# EAGLE design DF32-revision-C (EAGLE 6.6.0)
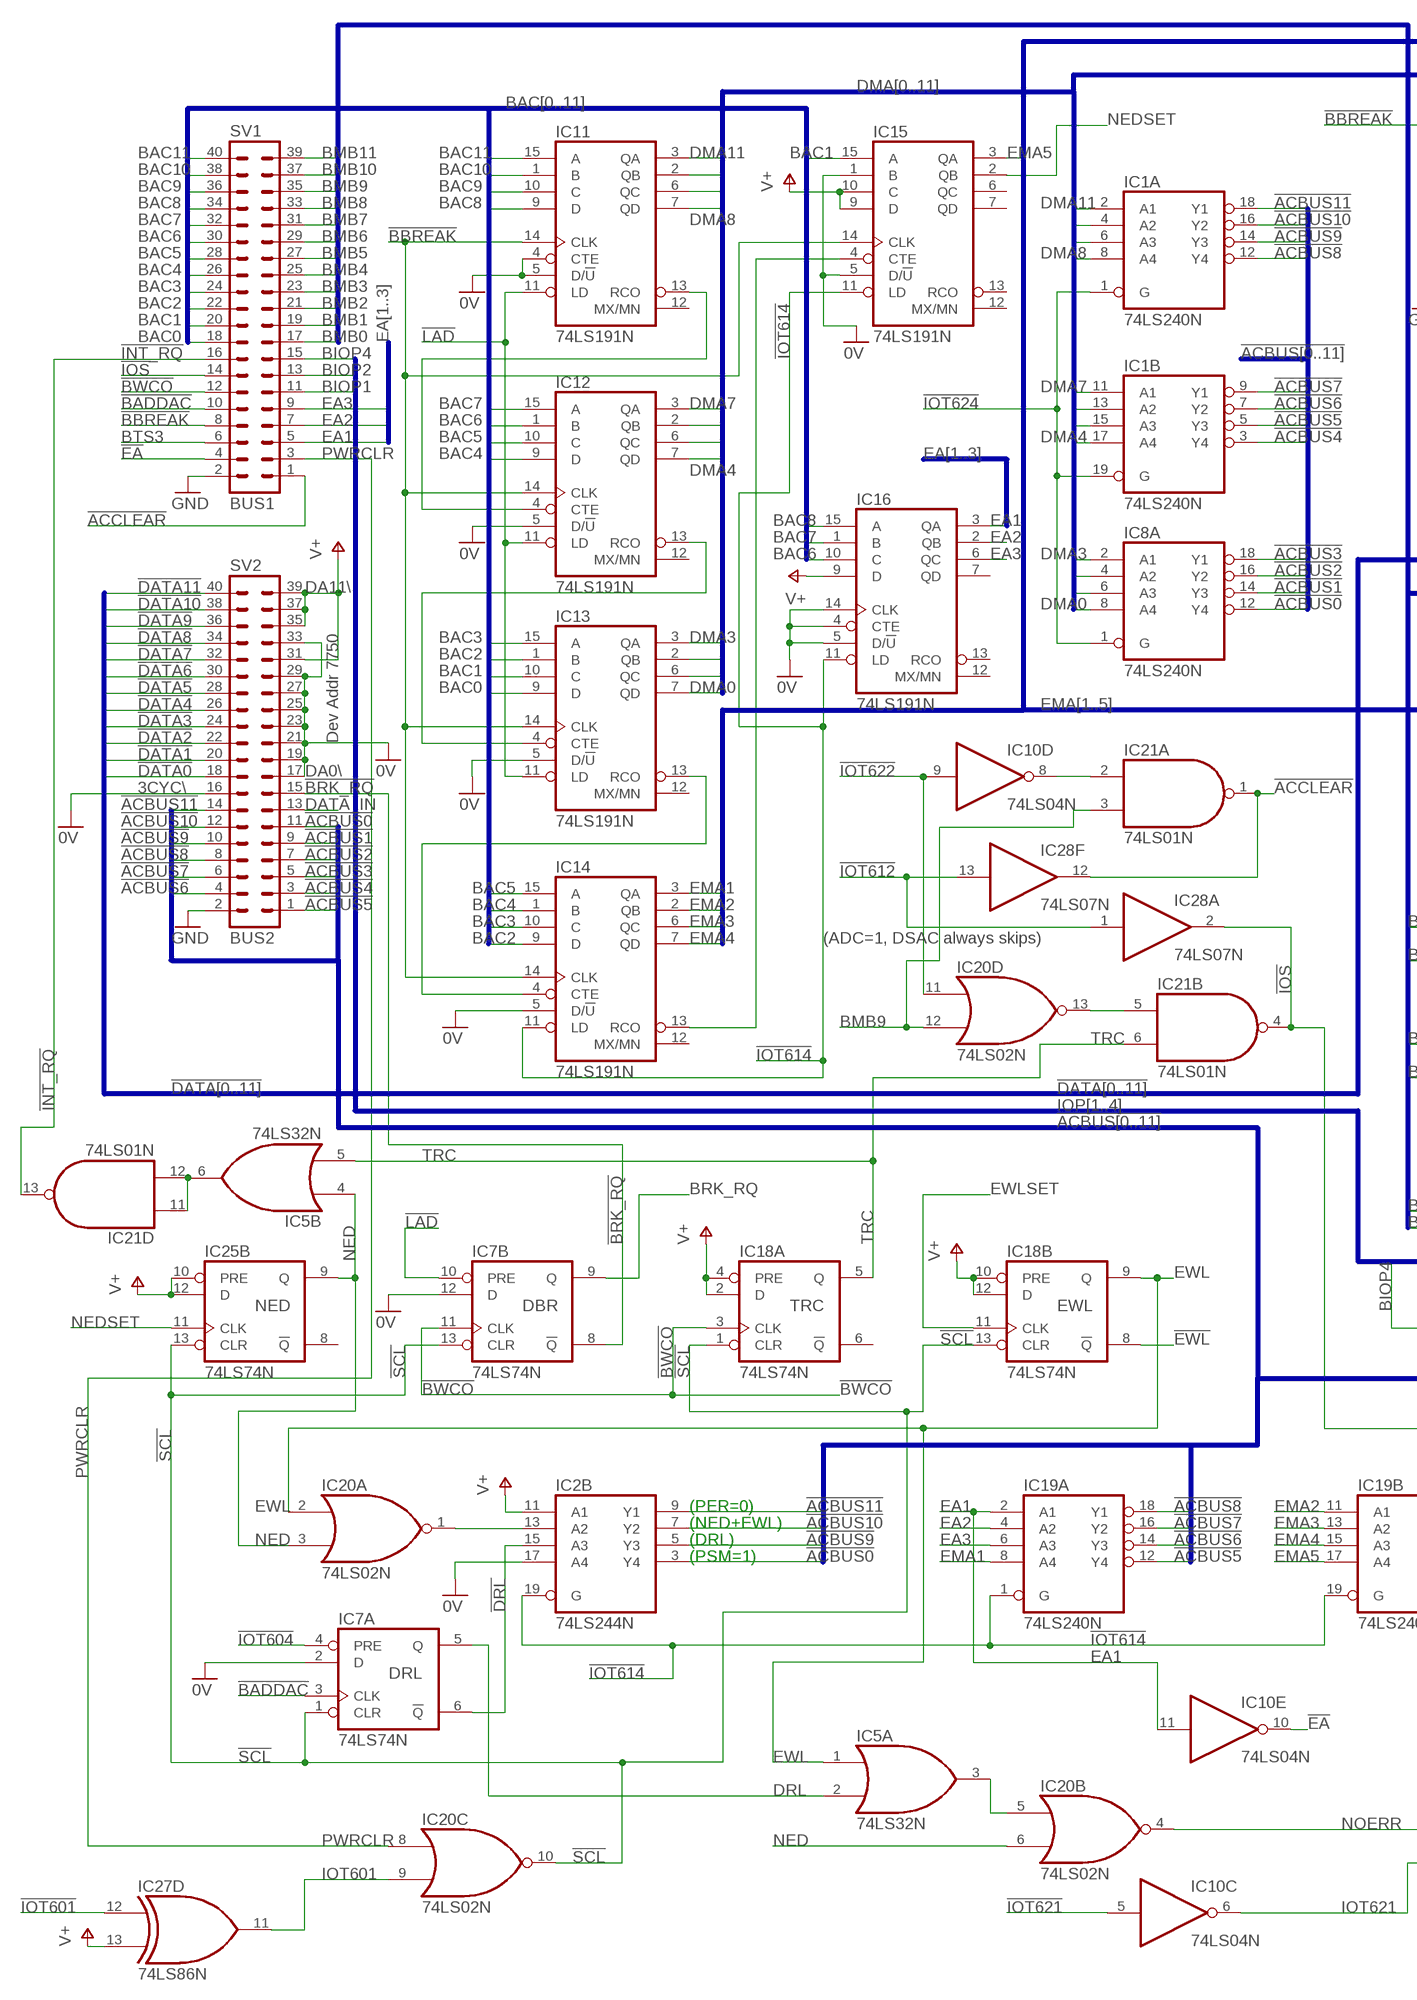
[diagram p0: schematic, sheet 1, part 1 of 2]
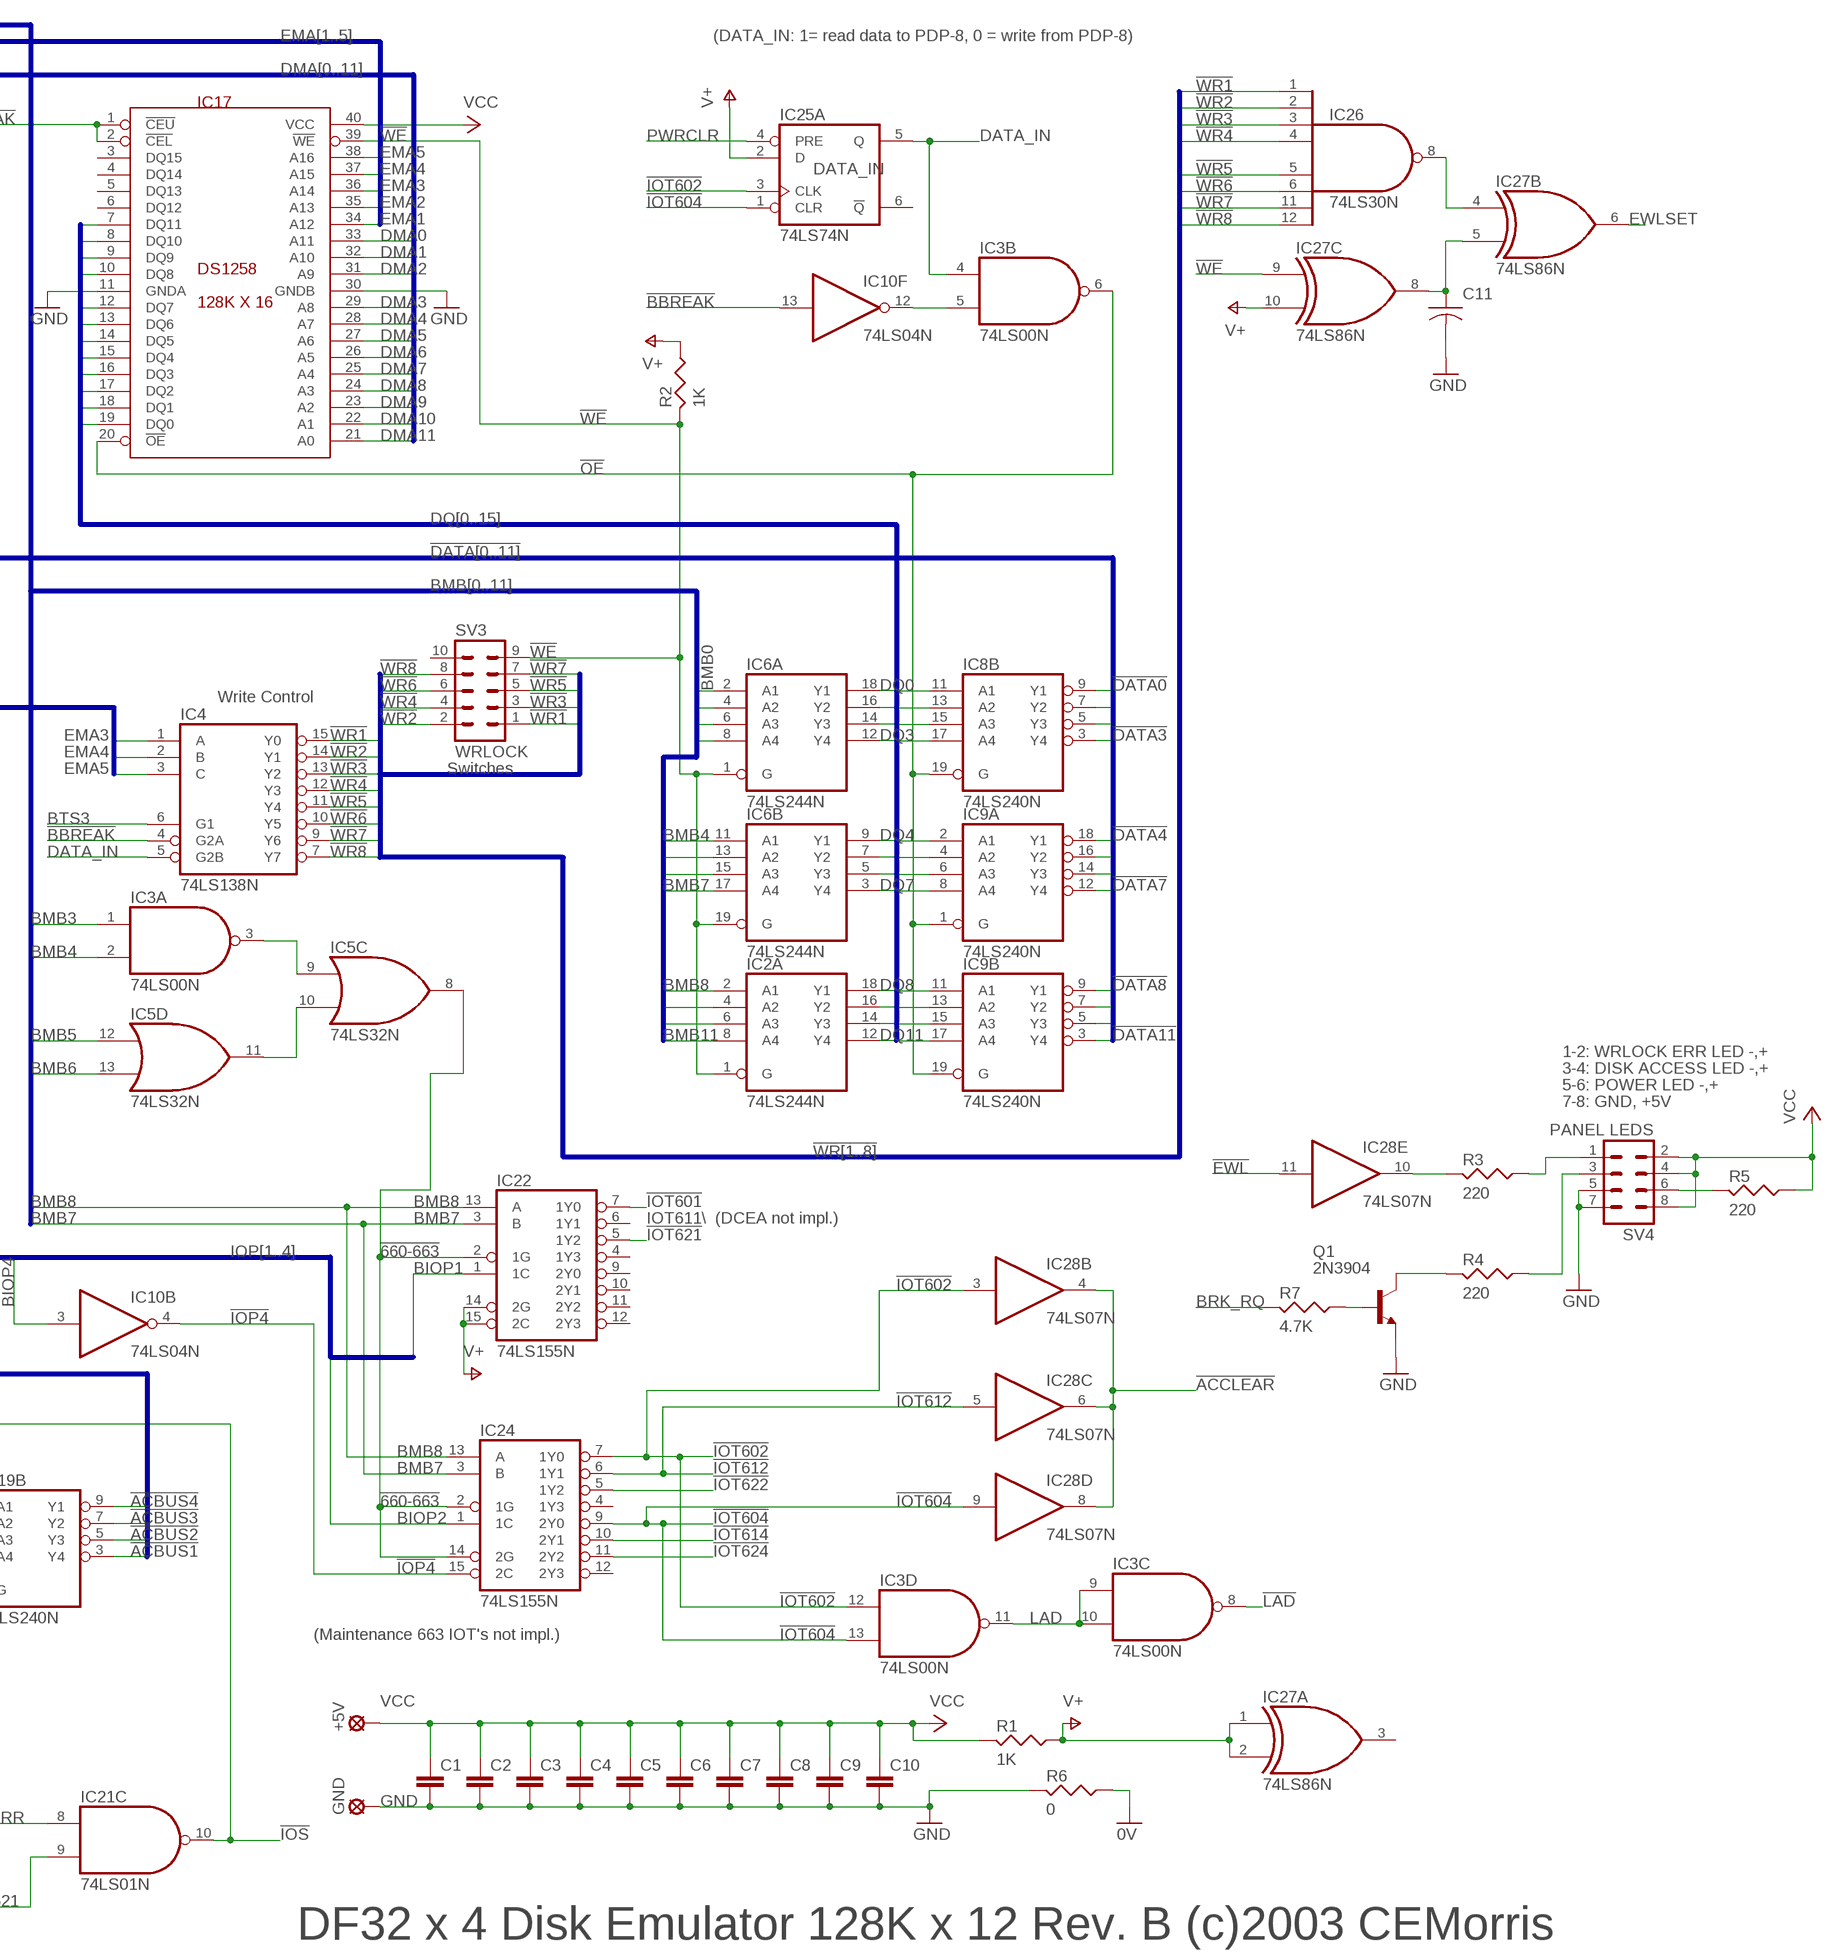
[diagram p1: schematic, sheet 1, part 2 of 2]

## Parts
+5V  SE14  [SE14]
C1  C5/3.5  [C5B3.5]
C2  C5/3.5  [C5B3.5]
C3  C5/3.5  [C5B3.5]
C4  C5/3.5  [C5B3.5]
C5  C5/3.5  [C5B3.5]
C6  C5/3.5  [C5B3.5]
C7  C5/3.5  [C5B3.5]
C8  C5/3.5  [C5B3.5]
C9  C5/3.5  [C5B3.5]
C10  C5/3.5  [C5B3.5]
C11  CAP-2,5  [C-2,5]
GND  SE14  [SE14]
IC1  74LS240N  [DIL20]
IC2  74LS244N  [DIL20]
IC3  74LS00N  [DIL14]
IC4  74LS138N  [DIL16]
IC5  74LS32N  [DIL14]
IC6  74LS244N  [DIL20]
IC7  74LS74N  [DIL14]
IC8  74LS240N  [DIL20]
IC9  74LS240N  [DIL20]
IC10  74LS04N  [DIL14]
IC11  74LS191N  74LS190N  [DIL16]
IC12  74LS191N  74LS190N  [DIL16]
IC13  74LS191N  74LS190N  [DIL16]
IC14  74LS191N  74LS190N  [DIL16]
IC15  74LS191N  74LS190N  [DIL16]
IC16  74LS191N  74LS190N  [DIL16]
IC17  DS1258  [DIL40]
IC18  74LS74N  [DIL14]
IC19  74LS240N  [DIL20]
IC20  74LS02N  [DIL14]
IC21  74LS01N  [DIL14]
IC22  74LS155N  [DIL16]
IC24  74LS155N  [DIL16]
IC25  74LS74N  [DIL14]
IC26  74LS30N  [DIL14]
IC27  74LS86N  [DIL14]
IC28  74LS07N  [DIL14]
Q1  2N3904  [TO92]
R1  1K  RESUS-5  [R-5]
R2  1K  RESUS-7,5  [R-7,5]
R3  220  RESUS-5  [R-5]
R4  220  RESUS-5  [R-5]
R5  220  RESUS-5  [R-5]
R6  0  RESUS-5  [R-5]
R7  4.7K  RESUS-5  [R-5]
SV1  BUS1  MA20-2  [MA20-2]
SV2  BUS2  MA20-2  [MA20-2]
SV3  WRLOCK  MA05-2  [MA05-2]
SV4  PANEL LEDS  MA04-2  [MA04-2]

## Nets
0V: IC2.17(B:A4) IC7.2(A:D) IC7.12(B:D) IC11.4(CTE) IC11.5(D/!U) IC12.5(D/!U) IC13.5(D/!U) IC14.5(D/!U) IC15.1(B) IC15.5(D/!U) IC16.4(CTE) IC16.5(D/!U) IC16.14(CLK) R6.1 SV2.16 SV2.17 SV2.19 SV2.21 SV2.23 SV2.25 SV2.27 SV2.29 SV2.33
!660-663: IC5.8(C:O) IC22.2(1G) IC24.2(1G) IC24.14(2G)
!(NED+EWL): IC2.13(B:A2) IC20.1(A:O)
!ACBUS0: IC2.3(B:Y4) IC8.12(A:Y4) SV2.11
!ACBUS1: IC8.14(A:Y3) IC19.3(B:Y4) SV2.9
!ACBUS2: IC8.16(A:Y2) IC19.5(B:Y3) SV2.7
!ACBUS3: IC8.18(A:Y1) IC19.7(B:Y2) SV2.5
!ACBUS4: IC1.3(B:Y4) IC19.9(B:Y1) SV2.3
!ACBUS5: IC1.5(B:Y3) IC19.12(A:Y4) SV2.1
!ACBUS6: IC1.7(B:Y2) IC19.14(A:Y3) SV2.4
!ACBUS7: IC1.9(B:Y1) IC19.16(A:Y2) SV2.6
!ACBUS8: IC1.12(A:Y4) IC19.18(A:Y1) SV2.8
!ACBUS9: IC1.14(A:Y3) IC2.5(B:Y3) SV2.10
!ACBUS10: IC1.16(A:Y2) IC2.7(B:Y2) SV2.12
!ACBUS11: IC1.18(A:Y1) IC2.9(B:Y1) SV2.14
!ACCLEAR: IC21.1(A:O) IC28.4(B:O) IC28.6(C:O) IC28.8(D:O) IC28.12(F:O) SV1.1
!BADDAC: IC7.3(A:CLK) SV1.10
!BBREAK: IC4.4(G2A) IC10.13(F:I) IC11.14(CLK) IC12.14(CLK) IC13.14(CLK) IC14.14(CLK) IC15.14(CLK) IC17.1(!CEU) IC17.2(!CEL) SV1.8
!BRK_RQ: IC7.8(B:!Q) SV2.15
!BWCO: IC7.11(B:CLK) IC18.3(A:CLK) SV1.12
!DATA0: IC8.9(B:Y1) SV2.18
!DATA1: IC8.7(B:Y2) SV2.20
!DATA2: IC8.5(B:Y3) SV2.22
!DATA3: IC8.3(B:Y4) SV2.24
!DATA4: IC9.18(A:Y1) SV2.26
!DATA5: IC9.16(A:Y2) SV2.28
!DATA6: IC9.14(A:Y3) SV2.30
!DATA7: IC9.12(A:Y4) SV2.32
!DATA8: IC9.9(B:Y1) SV2.34
!DATA9: IC9.7(B:Y2) SV2.36
!DATA10: IC9.5(B:Y3) SV2.38
!DATA11: IC9.3(B:Y4) SV2.40
!DRL: IC2.15(B:A3) IC7.6(A:!Q)
!EA: IC10.10(E:O) SV1.4
!EWL: IC18.8(B:!Q) IC28.11(E:I)
!INT_RQ: IC21.13(D:O) SV1.16
!IOP4: IC10.4(B:O) IC24.15(2C)
!IOS: IC21.4(B:O) IC21.10(C:O) IC28.2(A:O) SV1.14
!IOT601: IC22.7(1Y0) IC27.12(D:I0)
!IOT602: IC3.12(D:I0) IC24.7(1Y0) IC25.3(A:CLK) IC28.3(B:I)
!IOT604: IC3.13(D:I1) IC7.4(A:PRE) IC24.9(2Y0) IC25.1(A:CLR) IC28.9(D:I)
!IOT612: IC24.6(1Y1) IC28.1(A:I) IC28.5(C:I) IC28.13(F:I)
!IOT614: IC2.19(B:G) IC14.11(LD) IC15.11(LD) IC16.11(LD) IC19.1(A:G) IC19.19(B:G) IC24.10(2Y1)
!IOT621: IC10.5(C:I) IC22.5(1Y2)
!IOT622: IC10.9(D:I) IC20.11(D:I0) IC24.5(1Y2)
!IOT624: IC1.1(A:G) IC1.19(B:G) IC8.1(A:G) IC24.11(2Y2)
!LAD: IC3.8(C:O) IC7.10(B:PRE) IC11.11(LD) IC12.11(LD) IC13.11(LD)
!OE: IC3.6(B:O) IC8.19(B:G) IC9.1(A:G) IC9.19(B:G) IC17.20(!OE)
!SCL: IC7.1(A:CLR) IC7.13(B:CLR) IC18.1(A:CLR) IC18.13(B:CLR) IC20.10(C:O) IC25.13(B:CLR)
!WE: IC2.1(A:G) IC6.1(A:G) IC6.19(B:G) IC17.39(!WE) IC27.9(C:I0) R2.2 SV3.9
!WR1: IC4.15(Y0) IC26.1(I0) SV3.1
!WR2: IC4.14(Y1) IC26.2(I1) SV3.2
!WR3: IC4.13(Y2) IC26.3(I2) SV3.3
!WR4: IC4.12(Y3) IC26.4(I3) SV3.4
!WR5: IC4.11(Y4) IC26.5(I4) SV3.5
!WR6: IC4.10(Y5) IC26.6(I5) SV3.6
!WR7: IC4.9(Y6) IC26.11(I6) SV3.7
!WR8: IC4.7(Y7) IC26.12(I7) SV3.8
BAC0: IC13.9(D) SV1.18
BAC1: IC13.10(C) IC15.15(A) SV1.20
BAC2: IC13.1(B) IC14.9(D) SV1.22
BAC3: IC13.15(A) IC14.10(C) SV1.24
BAC4: IC12.9(D) IC14.1(B) SV1.26
BAC5: IC12.10(C) IC14.15(A) SV1.28
BAC6: IC12.1(B) IC16.10(C) SV1.30
BAC7: IC12.15(A) IC16.1(B) SV1.32
BAC8: IC11.9(D) IC16.15(A) SV1.34
BAC9: IC11.10(C) SV1.36
BAC10: IC11.1(B) SV1.38
BAC11: IC11.15(A) SV1.40
BIOP1: IC22.1(1C) SV1.11
BIOP2: IC24.1(1C) SV1.13
BIOP4: IC10.3(B:I) SV1.15
BMB0: IC6.2(A:A1) SV1.17
BMB1: IC6.4(A:A2) SV1.19
BMB2: IC6.6(A:A3) SV1.21
BMB3: IC3.1(A:I0) IC6.8(A:A4) SV1.23
BMB4: IC3.2(A:I1) IC6.11(B:A1) SV1.25
BMB5: IC5.12(D:I0) IC6.13(B:A2) SV1.27
BMB6: IC5.13(D:I1) IC6.15(B:A3) SV1.29
BMB7: IC6.17(B:A4) IC22.3(B) IC24.3(B) SV1.31
BMB8: IC2.2(A:A1) IC22.13(A) IC24.13(A) SV1.33
BMB9: IC2.4(A:A2) IC20.12(D:I1) IC21.3(A:I1) SV1.35
BMB10: IC2.6(A:A3) SV1.37
BMB11: IC2.8(A:A4) SV1.39
BRK_RQ: IC7.9(B:Q) R7.2
BTS3: IC4.6(G1) SV1.6
DATA_IN: IC3.4(B:I0) IC4.5(G2B) IC25.5(A:Q) SV2.13
DISK_LED: R4.1 SV4.3
DMA0: IC8.8(A:A4) IC13.7(QD) IC17.33(A11)
DMA1: IC8.6(A:A3) IC13.6(QC) IC17.32(A10)
DMA2: IC8.4(A:A2) IC13.2(QB) IC17.31(A9)
DMA3: IC8.2(A:A1) IC13.3(QA) IC17.29(A8)
DMA4: IC1.17(B:A4) IC12.7(QD) IC17.28(A7)
DMA5: IC1.15(B:A3) IC12.6(QC) IC17.27(A6)
DMA6: IC1.13(B:A2) IC12.2(QB) IC17.26(A5)
DMA7: IC1.11(B:A1) IC12.3(QA) IC17.25(A4)
DMA8: IC1.8(A:A4) IC11.7(QD) IC17.24(A3)
DMA9: IC1.6(A:A3) IC11.6(QC) IC17.23(A2)
DMA10: IC1.4(A:A2) IC11.2(QB) IC17.22(A1)
DMA11: IC1.2(A:A1) IC11.3(QA) IC17.21(A0)
DQ0: IC6.18(A:Y1) IC8.11(B:A1) IC17.19(DQ0)
DQ1: IC6.16(A:Y2) IC8.13(B:A2) IC17.18(DQ1)
DQ2: IC6.14(A:Y3) IC8.15(B:A3) IC17.17(DQ2)
DQ3: IC6.12(A:Y4) IC8.17(B:A4) IC17.16(DQ3)
DQ4: IC6.9(B:Y1) IC9.2(A:A1) IC17.15(DQ4)
DQ5: IC6.7(B:Y2) IC9.4(A:A2) IC17.14(DQ5)
DQ6: IC6.5(B:Y3) IC9.6(A:A3) IC17.13(DQ6)
DQ7: IC6.3(B:Y4) IC9.8(A:A4) IC17.12(DQ7)
DQ8: IC2.18(A:Y1) IC9.11(B:A1) IC17.10(DQ8)
DQ9: IC2.16(A:Y2) IC9.13(B:A2) IC17.9(DQ9)
DQ10: IC2.14(A:Y3) IC9.15(B:A3) IC17.8(DQ10)
DQ11: IC2.12(A:Y4) IC9.17(B:A4) IC17.7(DQ11)
DRL: IC5.2(A:I1) IC7.5(A:Q)
EA1: IC10.11(E:I) IC16.3(QA) IC19.2(A:A1) SV1.5
EA2: IC16.2(QB) IC19.4(A:A2) SV1.7
EA3: IC16.6(QC) IC19.6(A:A3) SV1.9
EMA1: IC14.3(QA) IC17.34(A12) IC19.8(A:A4)
EMA2: IC14.2(QB) IC17.35(A13) IC19.11(B:A1)
EMA3: IC4.1(A) IC14.6(QC) IC17.36(A14) IC19.13(B:A2)
EMA4: IC4.2(B) IC14.7(QD) IC17.37(A15) IC19.15(B:A3)
EMA5: IC4.3(C) IC15.3(QA) IC17.38(A16) IC19.17(B:A4)
EWL: IC5.1(A:I0) IC18.9(B:Q) IC20.2(A:I0)
EWLSET: IC18.11(B:CLK) IC27.6(B:O)
GND [supply]: C1.2 C2.2 C3.2 C4.2 C5.2 C6.2 C7.2 C8.2 C9.2 C10.2 C11.2 GND.MP IC17.11(GNDA) IC17.30(GNDB) Q1.3(E) R6.2 SV1.2 SV2.2 SV4.5 SV4.7
IOT601: IC20.9(C:I1) IC27.11(D:O)
IOT621: IC10.6(C:O) IC21.9(C:I1)
LAD: IC3.9(C:I0) IC3.10(C:I1) IC3.11(D:O)
N$1: C11.1 IC27.5(B:I1) IC27.8(C:O)
N$2: IC5.6(B:O) IC21.11(D:I0) IC21.12(D:I1)
N$3: IC28.10(E:O) R3.2
N$4: IC3.5(B:I1) IC10.12(F:O)
N$5: Q1.1(C) R4.2
N$6: R5.2 SV4.6
N$10: IC13.13(RCO) IC14.4(CTE)
N$11: IC12.13(RCO) IC13.4(CTE)
N$12: IC11.13(RCO) IC12.4(CTE)
N$13: IC3.3(A:O) IC5.9(C:I0)
N$14: IC14.13(RCO) IC15.4(CTE)
N$15: IC5.10(C:I1) IC5.11(D:O)
N$17: IC20.13(D:O) IC21.5(B:I0)
N$19: IC5.3(A:O) IC20.5(B:I0)
N$21: IC10.8(D:O) IC21.2(A:I0)
N$22: IC26.8(O) IC27.4(B:I0)
N$23: Q1.2(B) R7.1
NED: IC5.4(B:I0) IC20.3(A:I1) IC20.6(B:I1) IC25.9(B:Q)
NEDSET: IC15.2(QB) IC25.11(B:CLK)
NOERR: IC20.4(B:O) IC21.8(C:I0)
PWRCLR: IC20.8(C:I0) IC25.4(A:PRE) SV1.3
TRC: IC5.5(B:I1) IC18.5(A:Q) IC21.6(B:I1)
V+: IC2.11(B:A1) IC15.9(D) IC15.10(C) IC16.9(D) IC18.2(A:D) IC18.4(A:PRE) IC18.10(B:PRE) IC18.12(B:D) IC22.14(2G) IC22.15(2C) IC25.2(A:D) IC25.10(B:PRE) IC25.12(B:D) IC27.1(A:I0) IC27.2(A:I1) IC27.10(C:I1) IC27.13(D:I1) R1.1 R2.1 SV2.31 SV2.35 SV2.37 SV2.39
VCC [supply]: +5V.MP C1.1 C2.1 C3.1 C4.1 C5.1 C6.1 C7.1 C8.1 C9.1 C10.1 IC17.40(VCC) R1.2 R5.1 SV4.2 SV4.4 SV4.8
WRITELOCK_LED: R3.1 SV4.1
Unconnected: IC10.1(A:I) IC10.2(A:O) IC11.12(MX/MN) IC12.12(MX/MN) IC13.12(MX/MN) IC14.12(MX/MN) IC15.6(QC) IC15.7(QD) IC15.12(MX/MN) IC15.13(RCO) IC16.7(QD) IC16.12(MX/MN) IC16.13(RCO) IC17.3(DQ15) IC17.4(DQ14) IC17.5(DQ13) IC17.6(DQ12) IC18.6(A:!Q) IC22.4(1Y3) IC22.6(1Y1) IC22.9(2Y0) IC22.10(2Y1) IC22.11(2Y2) IC22.12(2Y3) IC24.4(1Y3) IC24.12(2Y3) IC25.6(A:!Q) IC25.8(B:!Q) IC27.3(A:O) SV3.10

## Buses
BAC[0..11]
!DATA[0..11]
DMA[0..11]
EMA[1..5]
BMB[0..11]
EMA[3..5]
DQ[0..15]
IOP[1..4]
!ACBUS[0..11]
EA[1..3]
!WR[1..8]

## Notes on the sheet
- (DATA_IN: 1= read data to PDP-8, 0 = write from PDP-8)
- DATA_IN
- DA11\\
- Write Control
- Dev Addr 7750
- DA0\\ | Switches
- 3CYC\\
- (ADC=1, DSAC always skips)
- 1-2: WRLOCK ERR LED -,+
- 3-4: DISK ACCESS LED -,+
- 5-6: POWER LED -,+
- 7-8: GND, +5V
- IOT611\\  (DCEA not impl.)
- NED | DBR | TRC | EWL
- (PER=0)
- (NED+EWL)
- (DRL)
- (PSM=1)
- (Maintenance 663 IOT's not impl.)
- DRL
- DF32 x 4 Disk Emulator 128K x 12 Rev. B (c)2003 CEMorris

## Power pins joined to a net without a drawn wire
GND: IC1.10(P:GND) IC2.10(P:GND) IC3.7(P:GND) IC4.8(GND) IC5.7(P:GND) IC6.10(P:GND) IC7.7(P:GND) IC8.10(P:GND) IC9.10(P:GND) IC10.7(P:GND) IC11.8(GND) IC12.8(GND) IC13.8(GND) IC14.8(GND) IC15.8(GND) IC16.8(GND) IC18.7(P:GND) IC19.10(P:GND) IC20.7(P:GND) IC21.7(P:GND) IC22.8(GND) IC24.8(GND) IC25.7(P:GND) IC26.7(GND) IC27.7(P:GND) IC28.7(P:GND)
VCC: IC1.20(P:VCC) IC2.20(P:VCC) IC3.14(P:VCC) IC4.16(VCC) IC5.14(P:VCC) IC6.20(P:VCC) IC7.14(P:VCC) IC8.20(P:VCC) IC9.20(P:VCC) IC10.14(P:VCC) IC11.16(VCC) IC12.16(VCC) IC13.16(VCC) IC14.16(VCC) IC15.16(VCC) IC16.16(VCC) IC18.14(P:VCC) IC19.20(P:VCC) IC20.14(P:VCC) IC21.14(P:VCC) IC22.16(VCC) IC24.16(VCC) IC25.14(P:VCC) IC26.14(VCC) IC27.14(P:VCC) IC28.14(P:VCC)

## Library data of the parts
+5V GND = solpad:SE14: SOLDER PAD E1553, drill 1,4mm, distributor Buerklin, 07F820
C1-C10 = capacitor-wima:C: CAPACITOR naming: grid - package width
C11 = discrete:CAP-2,5
IC1 IC8 IC9 IC19 = 74xx-us:74*240: Octal BUFFER and LINE DRIVER, 3-state
IC2 IC6 = 74xx-us:74*244: Octal BUFFER and LINE DRIVER, 3-state
IC3 = 74xx-us:74*00: Quad 2-input NAND gate
IC4 = 74xx-us:74*138: 3-line to 8-line DECODER/DEMULTIPLEXER
IC5 = 74xx-us:74*32: Quad 2-input OR gate
IC7 IC18 IC25 = 74xx-us:74*74: Dual D type positive edge triggered FLIP FLOP, preset and clear
IC10 = 74xx-us:74*04: Hex INVERTER
IC11-IC16 = 74xx-us:74*190: Synchronous UP/DOWN COUNTER
IC17 = maxim:DS1258: DS1258 128K x 16 NVRAM
IC20 = 74xx-us:74*02: Quad 2-input NOR gate
IC21 = 74xx-us:74*01: Quad 2-input NAND gate, open collector
IC22 IC24 = 74xx-us:74*155: Dual 2-line to 4-line data DECODER/DEMULTIPLEXER
IC26 = 74xx-us:74*30: 8-input NAND gate
IC27 = 74xx-us:74*86: Quad 2-input EXCLUSIV-OR (XOR) gate
IC28 = 74xx-us:74*07: Hex BUFFER, open collector high-voltage output
Q1 = transistor-npn:2N3904: NPN Transistor
R1 R3-R7 = discrete:RESUS-5
R2 = discrete:RESUS-7,5
SV1 SV2 = con-lstb:MA20-2: PIN HEADER; OC_FARNELL: unknown; OC_NEWARK: unknown
SV3 = con-lstb:MA05-2: PIN HEADER; OC_FARNELL: unknown; OC_NEWARK: unknown
SV4 = con-lstb:MA04-2: PIN HEADER; OC_FARNELL: unknown; OC_NEWARK: unknown

## Net classes
1 supply: width 0.508 mm

## Board
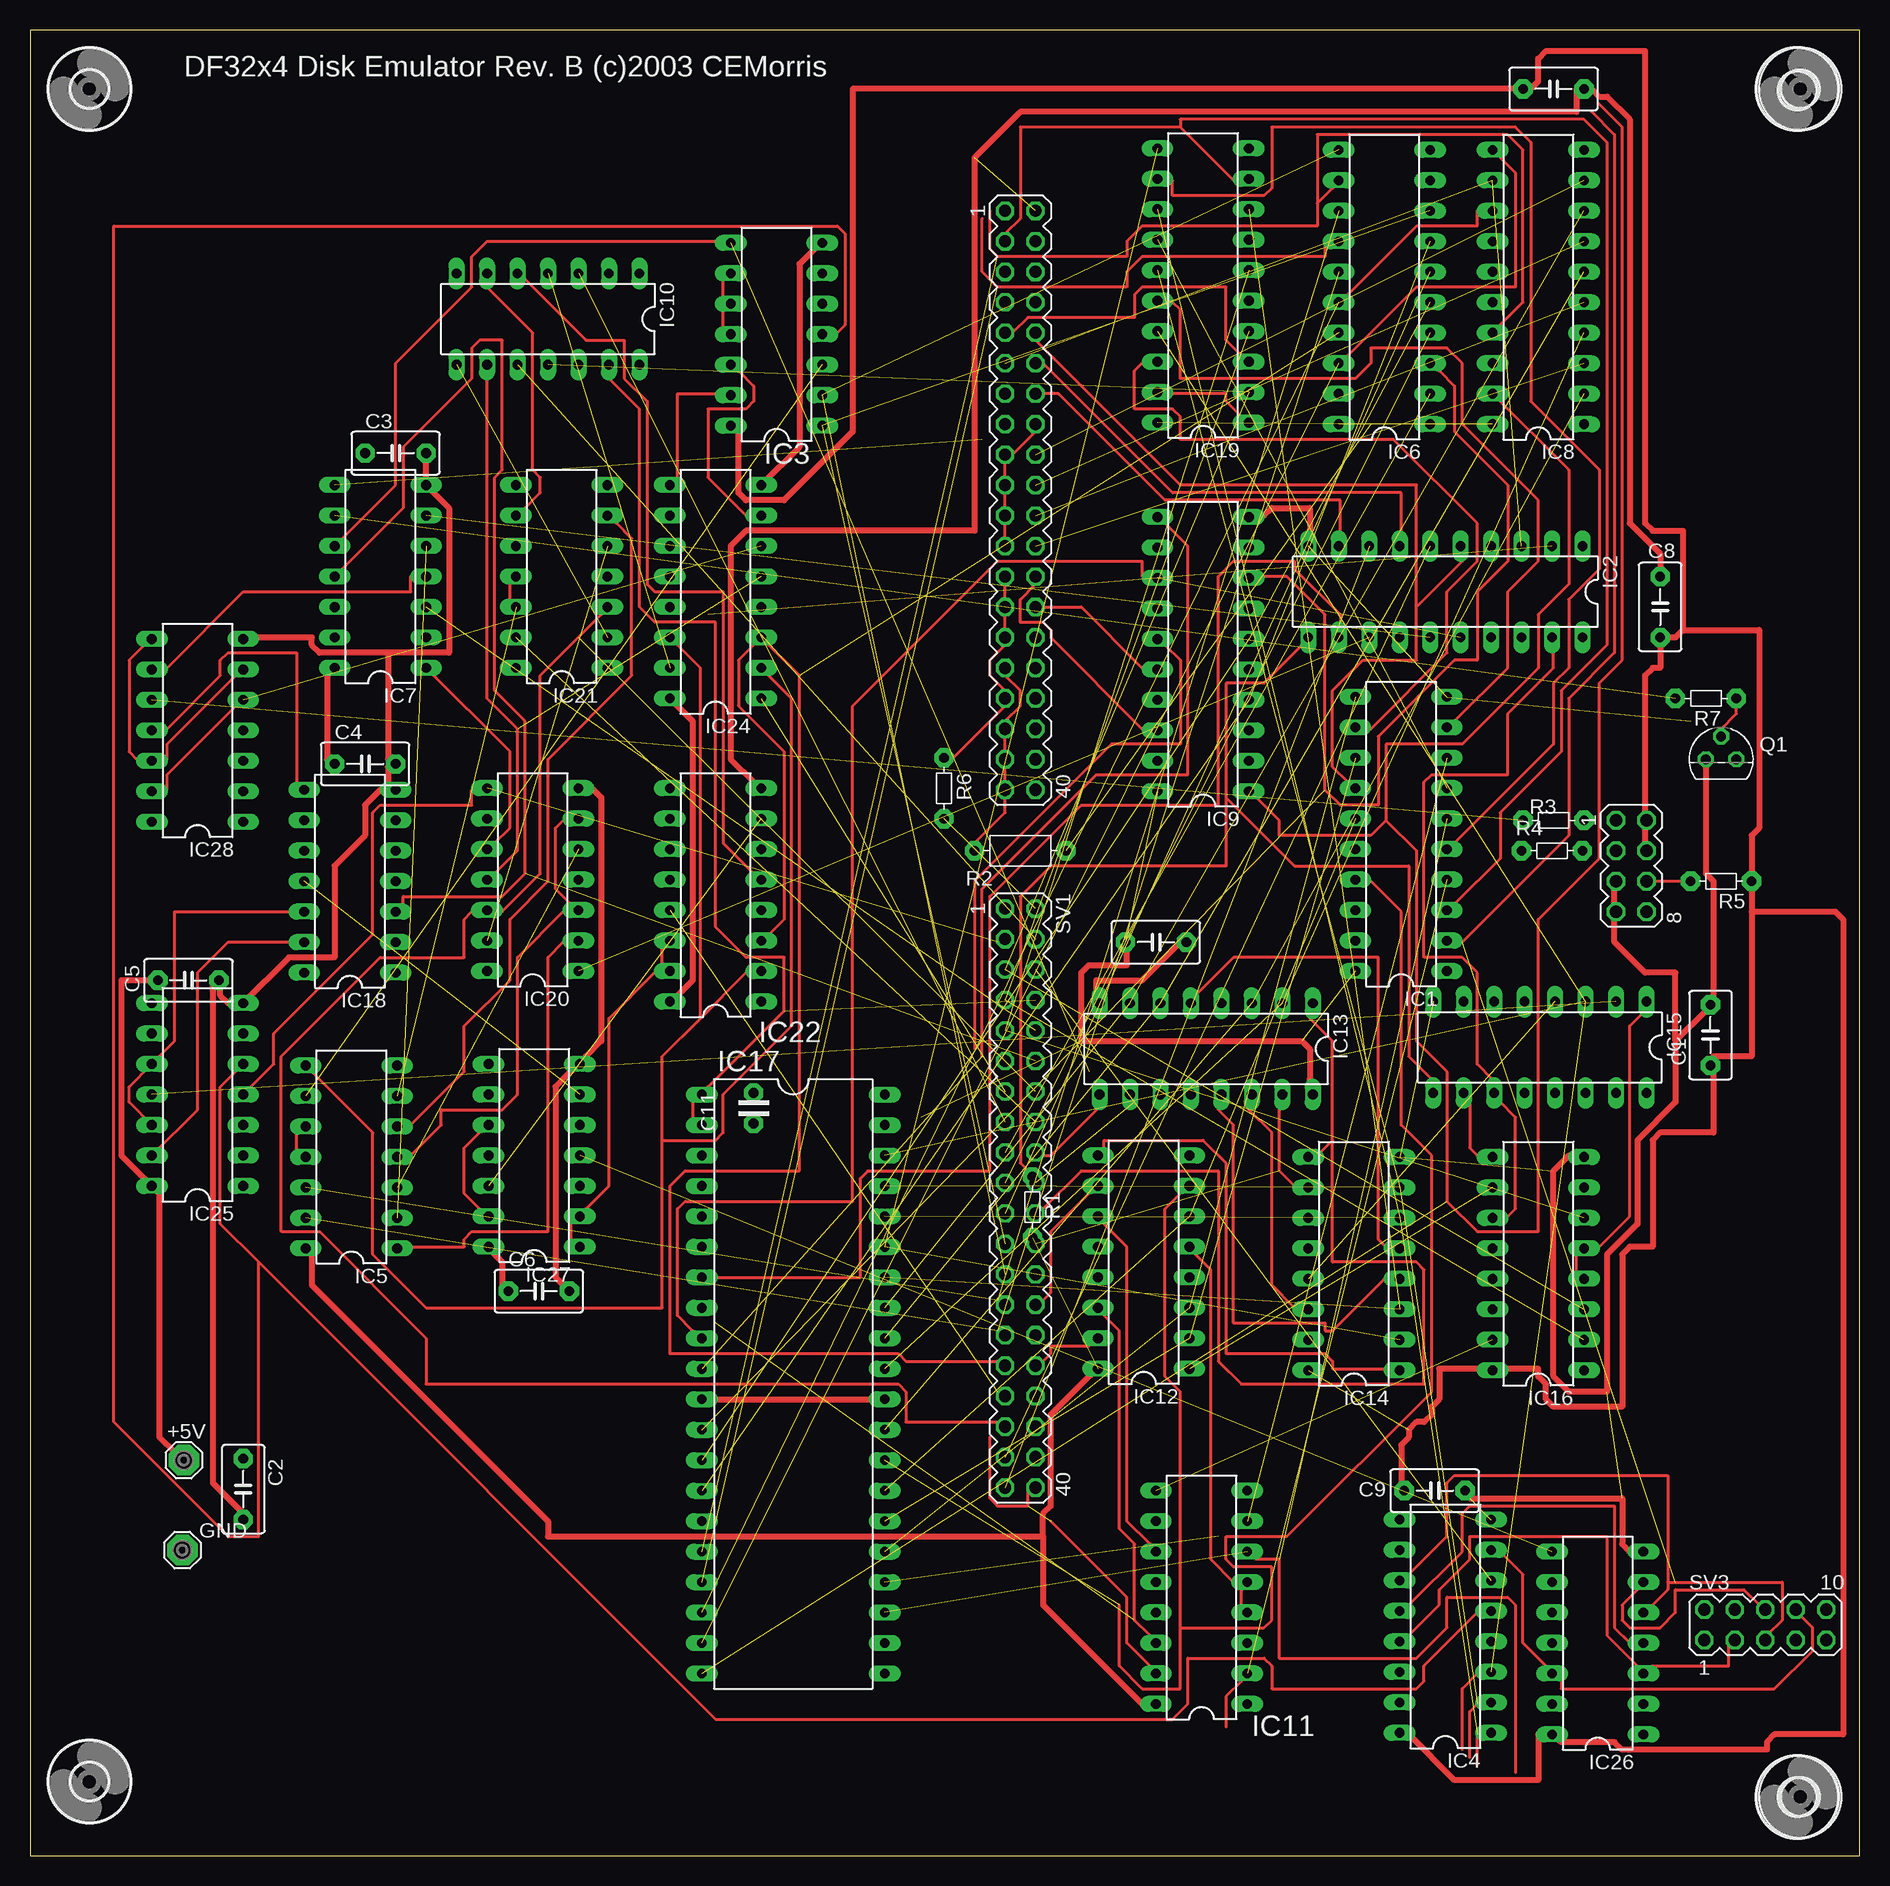
[diagram p2: board, top side]
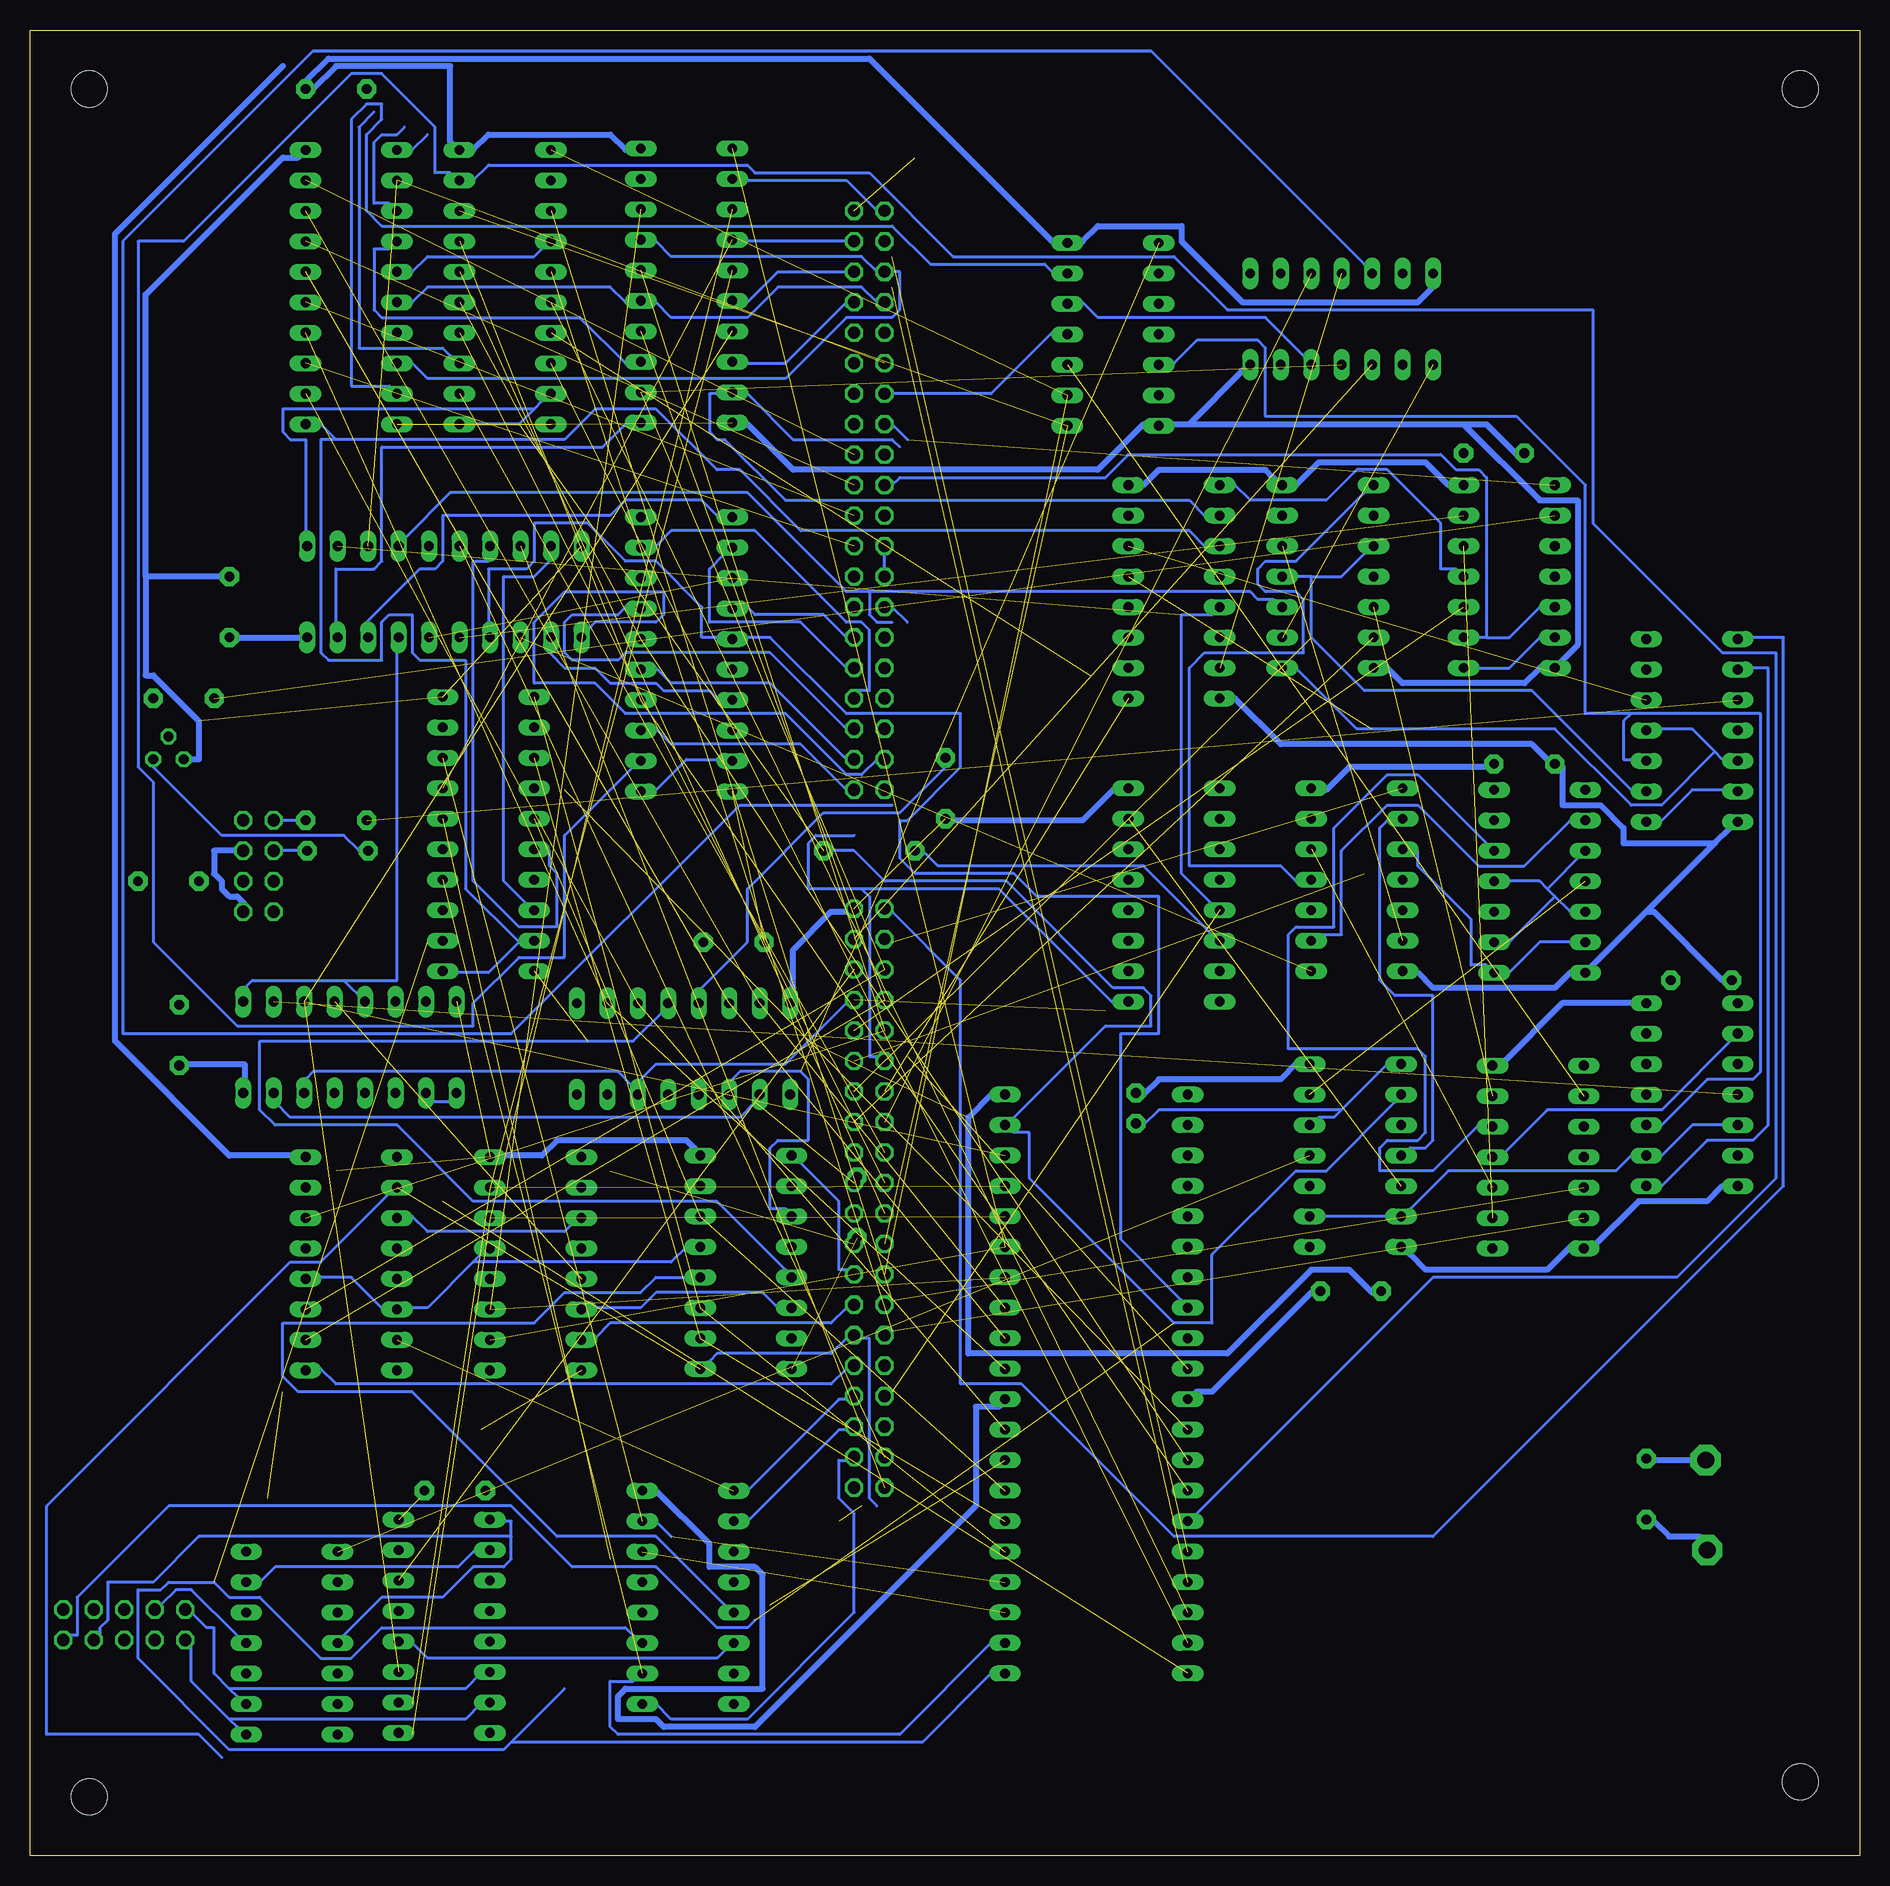
[diagram p3: board, bottom side, seen from below]

Size 152.51 x 152.2 mm. Coordinates in mm from the lower left corner, seen from the top.
Outline: 0,0 152.51,0 152.51,152.2 0,152.2 0,0
Copper layers (1*16): Top 0.035mm / dielectric 1.5mm / Bottom 0.035mm
Design rules "10mils": minimum track width 10mil, minimum drill 24mil, track to track 10mil, track to pad 10mil, pad to pad 10mil, via to via 10mil, smd to smd 10mil, copper to edge 40mil, drill to drill 10mil, minimum pad ring 10mil, minimum via ring 8mil, stop-mask expansion 0mil, vias tented up to drill 0mil, thermal gap 10mil

### Footprints (pad centres in the part's own frame; a part is rotated, then mirrored left to right if it is on the bottom)
SE14 = drill 1.397 pad 2.54 octagon: MP 0,0
C5B3.5 = drill 0.813 pad 1.6 octagon: 1 -2.54,0; 2 2.54,0
C-2,5 = drill 0.813 pad 1.6 octagon: 1 -1.27,0; 2 1.27,0
DIL20 = drill 0.813 long: 1 -11.43,-3.81; 2 -8.89,-3.81; 3 -6.35,-3.81; 4 -3.81,-3.81; 5 -1.27,-3.81; 6 1.27,-3.81; 7 3.81,-3.81; 8 6.35,-3.81; 9 8.89,-3.81; 10 11.43,-3.81; 11 11.43,3.81; 12 8.89,3.81; 13 6.35,3.81; 14 3.81,3.81; 15 1.27,3.81; 16 -1.27,3.81; 17 -3.81,3.81; 18 -6.35,3.81; 19 -8.89,3.81; 20 -11.43,3.81
DIL14 = drill 0.813 long: 1 -7.62,-3.81; 2 -5.08,-3.81; 3 -2.54,-3.81; 4 0,-3.81; 5 2.54,-3.81; 6 5.08,-3.81; 7 7.62,-3.81; 8 7.62,3.81; 9 5.08,3.81; 10 2.54,3.81; 11 0,3.81; 12 -2.54,3.81; 13 -5.08,3.81; 14 -7.62,3.81
DIL16 = drill 0.813 long: 1 -8.89,-3.81; 2 -6.35,-3.81; 3 -3.81,-3.81; 4 -1.27,-3.81; 5 1.27,-3.81; 6 3.81,-3.81; 7 6.35,-3.81; 8 8.89,-3.81; 9 8.89,3.81; 10 6.35,3.81; 11 3.81,3.81; 12 1.27,3.81; 13 -1.27,3.81; 14 -3.81,3.81; 15 -6.35,3.81; 16 -8.89,3.81
DIL40 = drill 0.813 long: 1 -24.13,-7.62; 2 -21.59,-7.62; 3 -19.05,-7.62; 4 -16.51,-7.62; 5 -13.97,-7.62; 6 -11.43,-7.62; 7 -8.89,-7.62; 8 -6.35,-7.62; 9 -3.81,-7.62; 10 -1.27,-7.62; 11 1.27,-7.62; 12 3.81,-7.62; 13 6.35,-7.62; 14 8.89,-7.62; 15 11.43,-7.62; 16 13.97,-7.62; 17 16.51,-7.62; 18 19.05,-7.62; 19 21.59,-7.62; 20 24.13,-7.62; 21 24.13,7.62; 22 21.59,7.62; 23 19.05,7.62; 24 16.51,7.62; 25 13.97,7.62; 26 11.43,7.62; 27 8.89,7.62; 28 6.35,7.62; 29 3.81,7.62; 30 1.27,7.62; 31 -1.27,7.62; 32 -3.81,7.62; 33 -6.35,7.62; 34 -8.89,7.62; 35 -11.43,7.62; 36 -13.97,7.62; 37 -16.51,7.62; 38 -19.05,7.62; 39 -21.59,7.62; 40 -24.13,7.62
TO92 = drill 0.813 octagon: 1 1.27,0; 2 0,1.905; 3 -1.27,0
R-5 = drill 0.813 pad 1.6 octagon: 1 -2.54,0; 2 2.54,0
R-7,5 = drill 0.813 pad 1.6 octagon: 1 -3.81,0; 2 3.81,0
MA20-2 = drill 1.016 octagon: 1 -24.13,-1.27; 2 -24.13,1.27; 3 -21.59,-1.27; 4 -21.59,1.27; 5 -19.05,-1.27; 6 -19.05,1.27; 7 -16.51,-1.27; 8 -16.51,1.27; 9 -13.97,-1.27; 10 -13.97,1.27; 11 -11.43,-1.27; 12 -11.43,1.27; 13 -8.89,-1.27; 14 -8.89,1.27; 15 -6.35,-1.27; 16 -6.35,1.27; 17 -3.81,-1.27; 18 -3.81,1.27; 19 -1.27,-1.27; 20 -1.27,1.27; 21 1.27,-1.27; 22 1.27,1.27; 23 3.81,-1.27; 24 3.81,1.27; 25 6.35,-1.27; 26 6.35,1.27; 27 8.89,-1.27; 28 8.89,1.27; 29 11.43,-1.27; 30 11.43,1.27; 31 13.97,-1.27; 32 13.97,1.27; 33 16.51,-1.27; 34 16.51,1.27; 35 19.05,-1.27; 36 19.05,1.27; 37 21.59,-1.27; 38 21.59,1.27; 39 24.13,-1.27; 40 24.13,1.27
MA05-2 = drill 1.016 octagon: 1 -5.08,-1.27; 2 -5.08,1.27; 3 -2.54,-1.27; 4 -2.54,1.27; 5 0,-1.27; 6 0,1.27; 7 2.54,-1.27; 8 2.54,1.27; 9 5.08,-1.27; 10 5.08,1.27
MA04-2 = drill 1.016 octagon: 1 -3.81,-1.27; 2 -3.81,1.27; 3 -1.27,-1.27; 4 -1.27,1.27; 5 1.27,-1.27; 6 1.27,1.27; 7 3.81,-1.27; 8 3.81,1.27
3,0 = hole 3: 0,0

### Placement (x,y rotation side)
+5V  12.82,32.98 0 top
C1  140.08,68.42 90 top
C2  17.78,30.57 270 top
C3  30.48,116.93 0 top
C4  27.94,91.02 0 top
C5  13.2,72.99 0 top
C6  42.41,47.08 0 top
C7  93.85,76.16 0 top
C8  135.88,104.1 90 top
C9  117.09,30.44 0 top
C10  127,147.28 0 top
C11  60.32,62.32 90 top
GND  12.69,25.49 0 top
IC1  114.3,85.18 90 top
IC2  117.98,105.37 180 top
IC3  62.22,126.84 90 top
IC4  117.98,19.14 90 top
IC5  26.79,58.26 90 top
IC6  112.9,130.77 90 top
IC7  29.21,106.64 90 top
IC8  125.73,130.77 90 top
IC9  97.79,100.17 90 top
IC10  43.17,128.1 180 top
IC11  97.66,21.55 90 top
IC12  92.83,49.49 90 top
IC13  98.04,67.27 180 top
IC14  110.36,49.37 90 top
IC15  125.85,67.4 180 top
IC16  125.73,49.37 90 top
IC17  63.62,39.33 270 top
IC18  26.67,81.24 90 top
IC19  97.79,130.9 90 top
IC20  41.9,81.37 90 top
IC21  44.32,106.64 90 top
IC22  57.14,80.1 90 top
IC24  57.14,105.37 90 top
IC25  13.96,63.46 90 top
IC26  130.68,17.74 90 top
IC27  42.03,58.38 90 top
IC28  13.96,93.81 90 top
Q1  140.97,91.4 0 top
R1  83.56,54.06 270 top
R2  82.55,83.78 0 top
R3  127,86.32 180 top
R4  126.87,83.78 180 top
R5  140.97,81.24 180 top
R6  76.2,88.99 270 top
R7  139.69,96.48 180 top
SV1  82.55,54.83 270 top
SV2  82.55,112.99 270 top
SV3  144.65,19.27 0 top
SV4  133.47,82.51 270 top
U$1  [3,0]  4.95,147.28 0 top
U$2  [3,0]  4.95,6.18 0 top
U$3  [3,0]  147.57,4.92 0 top
U$4  [3,0]  147.57,147.28 0 top

### Tracks (layer width: path | path; a pad name or v marks a point on that pad's centre or on a via)
0V
  Top 0.254: SV2.25 SV2.27 SV2.29 81.28,100.93 80.01,99.66 80.01,98.39 81.28,97.12 SV2.33 81.28,95.85 76.83,91.4 R6.1 | SV2.23 SV2.21 SV2.19 SV2.17 81.91,116.8 83.81,118.71 SV2.16 | IC11.4 100.96,20.92 100.96,22.19 IC11.5 100.33,22.82 98.42,24.73 98.42,48.86 97.15,50.13 IC12.5 | IC16.4 128.9,48.22 128.9,50.13 IC16.5 130.81,50.76 133.34,53.3 133.34,69.18 134.62,70.45 IC15.1 | IC13.5 97.15,71.72 100.33,74.89 112.39,74.89 112.39,51.4 113.03,50.76 IC14.5
  Bottom 0.254: IC13.5 96.52,72.35 92.7,76.16 92.7,80.61 86.36,86.96 80.01,86.96 76.2,90.77 R6.1 | SV2.25 SV2.23 | 79.37,102.83 80.64,104.1 SV2.27 | 126.36,72.99 133.98,72.99 134.62,72.35 IC15.1 | 126.36,72.99 IC15.5 | 126.36,72.99 121.92,72.99 121.92,100.29 IC2.17 | IC16.4 128.27,48.22 125.73,48.22 123.19,45.68 IC16.14 120.65,45.68 119.38,45.68 115.56,49.49 | 115.56,49.49 114.93,50.13 IC14.5 | 115.56,49.49 99.06,49.49 97.79,50.76 IC12.5 | 31.11,101.56 29.21,101.56 26.67,104.1 IC7.12 | 31.11,101.56 IC7.2 | 31.11,101.56 31.11,114.9 31.75,115.53 33.65,115.53 34.92,116.8 60.95,116.8 62.86,114.9 80.01,114.9 80.64,114.26 SV2.19
!660-663
  Top 0.254: 52.7,59.65 52.7,66.64 55.88,69.81 | 52.7,59.65 52.7,45.68 33.02,45.68 28.57,50.13 28.57,60.29 IC5.8 | 55.88,69.81 59.68,73.62 IC22.2 | 55.88,69.81 55.88,99.02 IC24.14 | 52.7,59.65 57.14,59.65 57.78,60.29 57.78,63.46 63.49,69.18 63.49,96.48 IC24.2
!(NED+EWL)  (1 unrouted)
!ACBUS0  (2 unrouted)
!ACBUS1
  Top 0.254: SV2.9 81.91,126.96 83.18,128.23 92.07,128.23 92.07,130.14 92.7,130.77 99.69,130.77 99.69,126.33 100.96,125.06 IC19.3
  Bottom 0.254: IC19.3 102.87,124.42 106.68,128.23 123.19,128.23 123.82,128.87 123.82,133.95 122.55,133.95 IC8.14
!ACBUS2
  Bottom 0.254: IC8.16 120.65,129.5 119.38,130.77 104.14,130.77 102.87,129.5 IC19.5 100.33,129.5 99.06,128.23 92.7,128.23 90.17,130.77 83.18,130.77 81.91,129.5 SV2.7
!ACBUS3
  Bottom 0.254: IC8.18 120.65,124.42 119.38,123.15 89.53,123.15 84.45,128.23 80.64,128.23 80.01,128.87 80.01,132.04 SV2.5 81.91,132.04 83.18,133.31 99.06,133.31 100.33,134.58 IC19.7
!ACBUS4
  Top 0.254: 95.88,144.11 100.33,139.66 IC19.9 | 95.88,144.11 82.55,144.11 82.55,136.49 81.28,135.22 SV2.3 | 95.88,144.11 95.88,144.74 129.53,144.74 131.44,142.84 131.44,100.93 127.63,97.12 127.63,92.04 122.55,86.96 122.55,83.15 118.74,79.34 IC1.3
!ACBUS5
  Top 0.254: IC1.5 118.74,84.42 127,92.67 127,97.75 128.27,99.02 128.27,104.74 130.81,107.28 130.81,115.53 125.09,121.25 125.09,142.84 123.82,144.11 103.5,144.11 103.5,139.03 102.87,138.39 95.25,138.39 95.25,139.66 IC19.12
  Bottom 0.254: SV2.1 81.91,137.12 84.45,139.66 92.7,139.66 IC19.12
!ACBUS6  (1 unrouted)
  Bottom 0.254: IC19.14 92.7,134.58 SV2.4
!ACBUS7
  Top 0.254: IC1.9 118.74,94.58 123.19,99.02 123.19,105.37 125.73,107.91 125.73,112.99 119.38,119.34 119.38,124.42 118.11,125.69 111.76,125.69 111.76,124.42 110.48,123.15 95.88,123.15 95.88,128.87 95.25,129.5 IC19.16
  Bottom 0.254: IC19.16 92.7,129.5 90.17,132.04 SV2.6
!ACBUS8
  Top 0.254: IC1.12 111.76,93.94 118.11,100.29 118.11,105.37 120.65,107.91 120.65,111.09 113.66,118.07 95.88,118.07 95.88,119.98 95.25,120.61 92.07,120.61 92.07,123.79 92.7,124.42 IC19.18
  Bottom 0.254: SV2.8 84.45,129.5 89.53,124.42 92.7,124.42 IC19.18
!ACBUS9
  Top 0.254: 115.56,104.1 115.56,99.66 111.12,99.66 108.58,97.12 108.58,90.77 109.85,89.5 IC1.14 | 115.56,104.1 119.38,107.91 IC2.5 | 115.56,104.1 115.56,114.26 95.88,114.26 83.81,126.33 SV2.10
!ACBUS10
  Top 0.254: SV2.12 84.45,124.42 95.25,113.63 114.3,113.63 114.3,110.45 IC2.7
  Bottom 0.254: IC1.16 109.22,83.78 109.22,82.51 108.58,81.88 108.58,77.43 111.76,77.43 115.56,81.24 115.56,107.91 114.3,107.91 IC2.7
!ACBUS11
  Top 0.254: SV2.14 85.72,121.88 94.61,112.99 109.22,112.99 109.22,110.45 IC2.9
  Bottom 0.254: IC1.18 111.12,79.34 113.03,81.24 113.03,106.64 110.48,106.64 109.22,107.91 IC2.9
!ACCLEAR
  Top 0.254: IC28.8 9.52,100.93 8.25,99.66 8.25,92.04 8.88,91.4 IC28.12 11.42,91.4 11.42,92.67 17.14,98.39 IC28.6
  Bottom 0.254: 12.06,92.04 13.96,93.94 16.51,93.94 IC28.4 | 12.06,92.04 11.42,91.4 IC28.12 | 12.06,92.04 16.51,87.59 19.05,87.59 25.39,93.94 41.9,93.94 46.98,99.02 IC21.1 | SV1.1 80.64,78.7 74.93,72.99 74.93,39.33 69.84,39.33 57.14,26.63 35.55,26.63 6.34,55.84 6.34,101.56 8.88,101.56 IC28.8
!BADDAC  (1 unrouted)
!BBREAK  (1 unrouted)
  Top 0.254: IC13.14 101.59,62.19 103.5,60.29 103.5,47.59 105.41,45.68 IC14.14 | IC11.14 93.34,18.38 92.07,19.65 92.07,26 90.8,27.27 90.8,43.78 89.53,45.05 IC12.14 | IC10.13 48.25,123.15 50.79,120.61 50.79,104.1 52.06,102.83 57.14,102.83 57.14,77.43 59.68,74.89 62.86,74.89 62.86,70.45 56.51,64.1 IC17.1 55.24,62.83 55.24,61.56 IC17.2
  Bottom 0.254: IC11.14 94.61,17.11 95.25,16.47 119.38,16.47 120.65,17.74 IC4.4 | IC12.14 90.17,45.68 91.44,46.95 100.33,46.95 101.59,45.68 105.41,45.68 IC14.14 | IC15.14 129.53,64.73 128.9,65.37 103.5,65.37 102.23,64.1 IC13.14 101.59,64.73 100.33,66 89.53,66 84.45,71.08 SV1.8
!BRK_RQ  (1 unrouted)
  Bottom 0.254: 79.37,118.07 80.64,119.34 SV2.15
!BWCO  (1 unrouted)
  Top 0.254: IC7.11 31.11,112.36 31.11,117.44 36.82,123.15 36.82,125.69 37.46,126.33 39.36,126.33 39.36,115.53 38.73,114.9 38.73,97.12 41.27,94.58 41.27,81.88 39.36,79.97 31.11,79.97 31.11,79.34 IC18.3
!DATA0  (1 unrouted)
!DATA1  (1 unrouted)
!DATA2  (1 unrouted)
!DATA3  (1 unrouted)
!DATA4
  Top 0.254: IC9.18 92.7,93.94 85.09,101.56 85.09,102.2 84.45,102.83 82.55,102.83 82.55,104.74 83.81,106.01 SV2.26
!DATA5
  Top 0.254: IC9.16 92.7,99.02 87.62,104.1 SV2.28
!DATA6
  Bottom 0.254: IC9.14 92.7,104.1 92.07,103.47 86.36,103.47 84.45,101.56 SV2.30
!DATA7
  Bottom 0.254: IC9.12 94.61,108.55 95.88,107.28 95.88,102.83 88.26,102.83 84.45,99.02 SV2.32
!DATA8
  Bottom 0.254: IC9.9 100.33,109.18 99.06,110.45 92.07,110.45 84.45,102.83 83.18,102.83 82.55,102.2 82.55,97.12 83.81,97.12 SV2.34
!DATA9
  Bottom 0.254: IC9.7 102.87,104.1 103.5,103.47 107.31,103.47 107.95,102.83 107.95,100.29 107.31,99.66 103.5,99.66 102.87,100.29 90.8,100.29 84.45,93.94 SV2.36
!DATA10
  Bottom 0.254: IC9.5 100.33,99.02 99.06,97.75 90.8,97.75 84.45,91.4 SV2.38
!DATA11
  Bottom 0.254: IC9.3 100.33,93.94 99.06,92.67 88.26,92.67 84.45,88.86 SV2.40
!DRL  (1 unrouted)
!EA  (1 unrouted)
!EWL
  Top 0.254: IC28.11 11.42,93.94 15.87,98.39 15.87,99.66 16.51,100.29 22.22,100.29 22.22,89.5 IC18.8
!INT_RQ  (1 unrouted)
!IOP4  (1 unrouted)
!IOS  (1 unrouted)
  Bottom 0.254: 45.71,106.64 45.71,101.56 41.27,97.12 27.3,97.12 19.05,88.86 IC28.2 | 45.71,106.64 IC21.4 | 45.71,106.64 43.17,106.64 41.27,108.55 IC21.10
!IOT601  (1 unrouted)
!IOT602
  Top 0.254: IC3.12 59.05,123.79 60.32,122.52 60.32,121.25 59.68,120.61 56.51,120.61 56.51,114.9 59.68,111.72 IC24.7
  Bottom 0.254: 19.05,95.21 8.25,95.21 8.25,65.37 8.88,64.73 12.69,64.73 16.51,60.92 IC25.3 | 19.05,95.21 19.68,94.58 19.68,91.4 19.05,91.4 IC28.3 | 19.05,95.21 22.86,95.21 22.86,114.26 28.57,119.98 49.52,119.98 49.52,125.69 50.16,126.33 55.24,126.33 57.14,124.42 IC3.12
!IOT604
  Top 0.254: IC3.13 57.14,121.88 53.97,121.88 53.97,114.9 IC24.9 | IC28.9 11.42,99.02 17.78,105.37 31.75,105.37 31.75,106.64 IC7.4
  Bottom 0.254: IC25.1 16.51,55.84 12.69,59.65 8.88,59.65 7.62,60.92 7.62,99.02 8.88,99.02 IC28.9 | IC24.9 52.06,114.26 50.79,112.99 44.45,112.99 41.9,115.53 39.36,115.53 34.92,111.09 34.92,107.28 33.65,107.28 IC7.4
!IOT612  (1 unrouted)
  Top 0.254: IC28.5 17.14,95.85 11.42,90.13 11.42,88.86 IC28.13
  Bottom 0.254: IC28.1 16.51,86.32 13.96,88.86 11.42,88.86 IC28.13
!IOT614
  Top 0.254: IC16.11 123.19,53.3 123.82,53.94 123.82,61.56 122.55,62.83 IC15.11 121.92,64.73 120.65,66 120.65,73.62 119.38,74.89 116.2,74.89 116.2,89.5 116.84,90.13 123.19,90.13 123.19,95.21 127,99.02 127,100.29 IC2.19 | IC19.19 95.25,121.88 99.69,121.88 99.69,121.25 100.96,119.98 IC19.1
  Bottom 0.254: 80.01,117.44 80.64,118.07 88.9,118.07 92.7,121.88 IC19.19 95.25,121.88 95.88,121.88 95.88,118.71 95.25,118.07 94.61,118.07 89.53,112.99 55.88,112.99 54.6,111.72 IC24.10 | IC14.11 107.31,52.67 107.95,52.03 119.38,52.03 120.65,53.3 IC16.11 | IC2.19 127,102.83 127,107.28 123.82,107.28 123.19,107.91 123.19,117.44 104.77,117.44 102.87,119.34 IC19.1
!IOT621
  Top 0.254: IC10.5 41.27,131.41 46.35,126.33 49.52,126.33 49.52,123.15 51.43,121.25 51.43,106.01 52.06,105.37 57.78,105.37 57.78,84.42 60.32,81.88 IC22.5
  Bottom 0.254: 80.64,87.59 93.34,87.59 112.39,68.54 144.78,68.54 144.78,134.58 128.9,150.46 59.05,150.46 41.27,132.68 IC10.5
!IOT622  (1 unrouted)
  Top 0.254: IC20.11 38.73,81.88 40.63,83.78 40.63,93.94 38.09,96.48 IC10.9
!IOT624
  Bottom 0.254: 111.76,76.16 114.3,73.62 116.84,73.62 IC1.1 | 127,118.07 107.95,118.07 105.41,120.61 100.33,120.61 95.25,115.53 93.34,115.53 88.26,110.45 55.88,110.45 54.6,109.18 IC24.11 | 127,118.07 128.27,119.34 IC8.1 | 111.76,76.16 116.2,80.61 116.2,99.66 120.01,99.66 120.65,100.29 120.65,103.47 122.55,103.47 123.19,102.83 123.19,99.66 127.63,99.66 128.27,100.29 128.27,118.07 127,118.07 | 111.76,76.16 IC1.19
!LAD  (1 unrouted)
  Top 0.254: IC11.11 93.34,26 91.44,27.9 91.44,50.76 89.53,52.67 IC12.11 | IC7.10 30.48,114.26 30.48,124.42 36.82,130.77 36.82,133.31 38.09,134.58 57.14,134.58 IC3.8
  Bottom 0.254: IC13.11 93.98,64.73 93.34,65.37 88.26,65.37 87.62,64.73 87.62,59.65 90.17,59.65 90.8,59.02 90.8,53.94 89.53,53.94 IC12.11
!OE  (1 unrouted)
  Top 0.254: 113.03,86.32 113.03,92.67 119.38,92.67 125.73,99.02 125.73,103.47 128.27,106.01 128.27,115.53 IC8.19 | 113.03,86.32 111.76,85.05 104.14,85.05 104.14,86.32 102.23,88.23 IC9.1 | 113.03,86.32 115.56,83.78 115.56,67.91 118.11,65.37 118.11,54.57 120.65,52.03 125.73,52.03 125.73,78.07 130.81,83.15 130.81,97.75 132.71,99.66 132.71,144.11 130.81,146.01
  Bottom 0.254: IC9.1 100.33,88.86 97.79,91.4 95.25,91.4 IC9.19 | IC3.6 67.31,132.04 67.94,132.68 77.47,132.68 80.64,135.85 123.19,135.85 124.45,137.12 124.45,143.47 123.19,144.74 123.19,146.01 124.45,146.01 125.73,144.74 125.73,122.52 122.55,122.52 IC8.19
!SCL
  Top 0.254: IC20.10 38.73,84.42 40,85.69 40,92.04 IC7.1 | IC25.13 13.96,62.19 13.96,73.62 16.51,76.16 IC18.13
  Bottom 0.254: IC7.13 26.67,101.56 29.21,99.02 IC7.1 | IC18.13 26.67,76.16 29.21,73.62 IC18.1 31.11,74.26 32.38,74.26 32.38,78.07 36.82,82.51 36.82,83.78 IC20.10
!WE  (2 unrouted)
  Bottom 0.254: 92.07,19.65 92.7,19.01 95.25,19.01 100.33,24.09 107.31,24.09 112.39,29.17 140.97,29.17 148.59,21.55 148.59,18.38 149.22,18.38 SV3.9 | R2.2 83.81,83.78 81.28,81.24 71.12,81.24 62.22,72.35 59.68,72.35 59.05,71.72 59.05,69.18 62.86,69.18 70.48,61.56 IC17.39 70.48,60.29 69.21,60.29 69.21,56.48 57.14,44.41 53.97,44.41 53.97,50.13 46.98,57.11 44.45,57.11 38.73,62.83 IC27.9 | 110.48,120.61 111.76,119.34 IC6.1 | 110.48,120.61 109.85,121.25 IC6.19 | 110.48,120.61 131.44,120.61 131.44,118.71 130.81,118.07 129.53,118.07 129.53,110.45 IC2.1
!WR1
  Bottom 0.254: 135.88,11.39 139.06,14.57 139.06,17.74 SV3.1 | 135.88,11.39 135.25,10.76 IC26.1 | 135.88,11.39 116.2,11.39 114.93,12.66 IC4.15
!WR2
  Bottom 0.254: 135.88,13.93 137.16,15.2 137.16,19.01 137.79,19.01 139.06,20.28 SV3.2 | 135.88,13.93 135.25,13.3 IC26.2 | 135.88,13.93 116.2,13.93 114.93,15.2 IC4.14
!WR3
  Top 0.254: SV3.3 141.6,17.74 141.6,15.84 135.25,15.84 IC26.3 133.98,15.84 131.44,18.38 131.44,26.63 120.01,26.63 120.01,24.73 117.47,22.19 117.47,20.92 114.93,18.38 IC4.13
!WR4
  Top 0.254: IC4.12 114.93,20.92 119.38,25.36 119.38,28.54 120.01,29.17 132.08,29.17 132.08,19.01 133.34,17.74 IC26.4
  Bottom 0.254: IC26.4 135.25,18.38 139.06,22.19 140.33,22.19 141.6,20.92 SV3.4
!WR5
  Top 0.254: 136.52,22.82 136.52,22.19 135.25,20.92 IC26.5 | 136.52,22.82 146.05,22.82 146.05,19.65 144.78,18.38 SV3.5 | 136.52,22.82 136.52,31.71 118.74,31.71 118.11,31.08 118.11,26.63 114.93,23.46 IC4.11
!WR6
  Top 0.254: SV3.6 144.14,20.92 142.87,22.19 137.16,22.19 137.16,20.28 135.88,19.01 133.34,19.01 132.71,19.65 132.71,20.92 133.98,22.19 IC26.6
  Bottom 0.254: IC26.6 133.34,22.82 132.08,24.09 116.84,24.09 115.56,25.36 114.93,25.36 IC4.10
!WR7
  Bottom 0.254: 112.39,26.63 112.39,27.9 113.03,27.9 IC4.9 | 112.39,26.63 112.39,24.73 113.03,24.09 115.56,24.09 118.11,21.55 123.19,21.55 126.36,18.38 IC26.11 | 112.39,26.63 138.43,26.63 142.24,22.82 146.05,22.82 146.05,19.65 146.68,19.01 146.68,18.38 SV3.7
!WR8
  Top 0.254: IC4.7 122.55,25.36 124.45,23.46 124.45,17.74 126.36,15.84 IC26.12 127.63,14.57 127.63,13.93 145.41,13.93 148.59,17.11 148.59,19.01 147.31,20.28 SV3.8
BAC0
  Top 0.254: IC13.9 88.9,62.19 85.09,58.38 84.45,58.38 SV1.18
BAC1  (1 unrouted)
  Bottom 0.254: IC13.10 92.07,62.83 93.34,61.56 130.81,61.56 132.08,62.83 IC15.15
BAC2
  Top 0.254: 108.58,59.65 107.31,58.38 IC14.9 | 108.58,59.65 108.58,67.91 106.68,69.81 IC13.1 | 108.58,59.65 108.58,49.49 115.56,49.49 116.2,48.86 116.2,39.33 100.96,39.33 99.06,41.24 99.06,57.11 87.62,57.11 84.45,53.94 SV1.22
BAC3  (1 unrouted)
  Top 0.254: IC14.10 105.41,55.84 104.14,57.11 104.14,62.19 IC13.15
BAC4
  Top 0.254: IC14.1 113.03,40.6 108.58,40.6 108.58,41.24 107.95,41.87 99.69,41.87 99.69,57.75 97.79,59.65 89.53,59.65 89.53,59.02 IC12.9
  Bottom 0.254: IC12.9 88.26,57.75 85.09,54.57 85.09,48.86 84.45,48.86 SV1.26
BAC5
  Top 0.254: IC12.10 88.26,55.21 85.09,52.03 85.09,46.95 84.45,46.32 SV1.28
  Bottom 0.254: IC14.15 105.41,43.14 104.14,44.41 85.72,44.41 84.45,45.68 SV1.28
BAC6  (1 unrouted)
  Bottom 0.254: IC12.1 95.88,41.24 95.25,41.87 85.72,41.87 84.45,43.14 SV1.30 83.18,43.14 82.55,43.14 82.55,29.81 81.91,29.17 | 136.52,8.22 138.43,10.12 151.12,10.12 151.12,29.17 130.81,49.49 128.27,49.49 122.55,55.21 IC16.10
BAC7
  Top 0.254: IC12.15 88.26,42.51 85.09,42.51 85.09,41.87 84.45,41.24 SV1.32
  Bottom 0.254: IC16.1 128.27,40.6 127,39.33 85.72,39.33 84.45,40.6 SV1.32
BAC8  (1 unrouted)
  Bottom 0.254: IC11.9 92.7,30.44 85.09,38.06 84.45,38.06 SV1.34
BAC9
  Bottom 0.254: IC11.10 92.7,27.9 85.09,35.52 84.45,35.52 SV1.36
BAC10
  Bottom 0.254: IC11.1 100.33,12.66 99.06,11.39 92.7,11.39 83.81,20.28 83.81,28.54 85.09,29.81 85.09,32.98 84.45,32.98 SV1.38
BAC11  (1 unrouted)
  Top 0.254: 85.09,27.9 91.44,21.55 91.44,17.74 93.34,15.84 IC11.15 | 80.01,34.89 80.01,29.81 80.64,29.17 83.18,29.17 83.18,30.44 SV1.40
BIOP1
  Bottom 0.254: 83.81,85.05 86.99,85.05 87.62,84.42 87.62,80.61 83.18,80.61 | 83.18,80.61 82.55,79.97 82.55,66.64 81.91,66.64 SV1.11 | 83.18,80.61 71.75,80.61 62.22,71.08 IC22.1
BIOP2  (1 unrouted)
BIOP4  (1 unrouted)
BMB0  (1 unrouted)
BMB1  (1 unrouted)
BMB2  (1 unrouted)
BMB3  (2 unrouted)
BMB4  (2 unrouted)
BMB5  (2 unrouted)
  Bottom 0.254: 80.64,46.32 SV1.27
BMB6  (2 unrouted)
  Bottom 0.254: 80.64,43.78 SV1.29
BMB7  (1 unrouted)
  Top 0.254: IC22.3 61.59,76.8 62.86,78.07 62.86,92.04 59.05,95.85 59.05,99.66 IC24.3 64.13,98.39 64.13,57.11 54.6,57.11 53.34,55.84 53.34,41.87 72.39,41.87 73.02,41.24 80.64,41.24 SV1.31
BMB8  (2 unrouted)
  Bottom 0.254: 80.64,38.7 SV1.33 | IC22.13 53.97,79.34 56.51,81.88 56.51,103.47 53.97,103.47 IC24.13
BMB9
  Top 0.254: IC21.3 47.62,103.47 42.54,98.39 42.54,81.88 39.36,78.7 IC20.12 36.82,78.7 36.19,78.07 36.19,74.89 29.21,74.89 20.95,66.64 20.95,52.03 24.12,52.03 33.02,43.14 33.02,39.33 72.39,39.33 73.02,38.7 73.02,36.16 80.64,36.16 SV1.35
  Bottom 0.254: 82.55,105.37 84.45,105.37 92.7,113.63 117.47,113.63 121.28,109.82 IC2.4 | 80.64,102.83 81.91,102.83 82.55,103.47 82.55,105.37 | SV1.35 80.64,36.16 | 82.55,105.37 50.79,105.37 50.16,104.74 48.89,104.74 IC21.3
BMB10  (1 unrouted)
BMB11  (1 unrouted)
BRK_RQ  (1 unrouted)
BTS3  (1 unrouted)
DATA_IN
  Top 0.254: IC4.5 120.65,20.28 116.2,15.84 116.2,14.57 115.56,13.93 103.5,13.93 103.5,15.84 102.87,16.47 96.52,16.47 96.52,12.66 95.25,11.39 57.14,11.39 19.05,49.49 | 19.05,49.49 15.87,52.67 15.87,64.1 IC25.5 | 19.05,49.49 19.05,26.63 16.51,26.63 6.98,36.16 6.98,135.85 67.31,135.85 67.94,135.22 67.94,127.6 67.31,126.96 IC3.4
  Bottom 0.254: IC3.4 67.31,126.96 72.39,121.88 80.64,121.88 SV2.13
DISK_LED
  Bottom 0.254: R4.1 SV4.3
DMA0  (2 unrouted)
DMA1  (2 unrouted)
DMA2  (2 unrouted)
DMA3  (2 unrouted)
DMA4  (1 unrouted)
  Top 0.254: 90.8,20.92 90.8,15.84 92.7,13.93 95.88,13.93 95.88,19.01 | 95.88,19.01 95.88,38.7 94.61,39.97 94.61,53.94 95.88,55.21 IC12.7 | 95.88,19.01 102.87,19.01 103.5,19.65 103.5,24.09 100.33,24.09 99.69,24.73 99.69,26.63 104.77,26.63 116.84,38.7 116.84,58.38 114.3,60.92 114.3,78.7 111.76,81.24 IC1.17
DMA5  (2 unrouted)
DMA6  (2 unrouted)
DMA7  (2 unrouted)
DMA8  (2 unrouted)
  Bottom 0.254: 99.06,26.63 100.33,27.9 IC11.7
DMA9  (2 unrouted)
  Top 0.254: 123.82,6.95 123.82,20.92 123.19,21.55 118.11,21.55 118.11,19.01 115.56,16.47 104.14,16.47 104.14,24.73 102.23,24.73 IC11.6
DMA10  (1 unrouted)
  Top 0.254: 99.69,10.76 99.69,13.3 100.96,14.57 IC11.2
  Bottom 0.254: IC17.22 72.39,17.74 80.01,10.12 103.5,10.12 104.14,10.76 104.14,14.57 102.23,14.57 IC11.2
DMA11  (1 unrouted)
  Top 0.254: 130.17,145.38 132.08,143.47 132.08,100.29 128.27,96.48 128.27,85.05 119.38,76.16 IC1.2
  Bottom 0.254: 112.39,9.49 113.03,8.85 135.88,8.85 143.5,16.47 143.5,22.19 141.6,22.19 140.97,22.82 137.16,22.82 135.88,21.55 133.34,21.55 128.27,16.47 125.73,16.47 123.19,19.01 102.87,19.01 102.23,18.38 IC11.3 | 112.39,9.49 107.95,13.93 | 112.39,9.49 78.1,9.49 72.39,15.2 IC17.21
DQ0  (1 unrouted)
  Top 0.254: IC6.18 109.85,125.06 115.56,130.77 123.82,130.77 123.82,140.3 IC8.11
  Bottom 0.254: 119.38,143.47 120.65,142.2 IC8.11
DQ1  (1 unrouted)
  Top 0.254: IC6.16 109.85,130.14 115.56,135.85 120.65,135.85 120.65,137.12 IC8.13
  Bottom 0.254: 121.28,144.11 121.92,143.47 123.19,143.47 123.82,142.84 123.82,137.76 122.55,137.76 IC8.13
DQ2  (1 unrouted)
  Top 0.254: 79.37,136.49 79.37,132.04 80.64,130.77 91.44,130.77 91.44,132.04 92.7,133.31 107.95,133.31 107.95,134.58 IC6.14
  Bottom 0.254: IC8.15 120.65,132.04 119.38,133.31 110.48,133.31 109.85,133.95 IC6.14
DQ3  (1 unrouted)
  Top 0.254: 80.01,137.12 80.01,133.95 80.64,133.31 91.44,133.31 91.44,134.58 92.7,135.85 107.31,135.85 107.31,137.76 | 107.31,137.76 108.58,139.03 IC6.12 | 107.31,137.76 107.31,143.47 123.19,143.47 124.45,142.2 124.45,129.5 IC8.17
DQ4
  Bottom 0.254: IC9.2 102.23,90.77 107.95,85.05 107.95,74.89 111.76,74.89 115.56,71.08 115.56,69.18 135.25,69.18 142.24,76.16 142.24,89.5 143.5,90.77 143.5,134.58 139.69,134.58 125.73,148.55 123.19,148.55 118.74,144.11 118.74,140.3 117.47,140.3 IC6.9 115.56,139.66 114.3,140.93 92.7,140.93 92.07,140.3 82.55,140.3 75.56,133.31 57.14,133.31 52.7,128.87 22.22,128.87 22.22,111.09 11.42,100.29 6.98,100.29 6.98,56.48 15.23,48.22 35.55,48.22 55.24,28.54 IC17.15
DQ5  (2 unrouted)
DQ6  (2 unrouted)
DQ7  (1 unrouted)
  Top 0.254: IC9.8 102.87,106.64 104.77,106.64 107.95,103.47 107.95,88.86 109.22,87.59 112.39,87.59 112.39,93.31 118.74,99.66 120.65,99.66 120.65,105.37 123.19,107.91 123.19,114.26 118.74,118.71 118.74,122.52 117.47,123.79 IC6.3
  Bottom 0.254: 123.82,145.38 125.09,144.11 125.09,125.69 118.11,125.69 117.47,125.06 IC6.3
DQ8  (1 unrouted)
  Top 0.254: 79.37,66.64 79.37,80.61 88.9,90.13 96.52,90.13 96.52,109.18 94.61,111.09 IC9.11
  Bottom 0.254: IC2.18 124.45,102.83 120.01,107.28 118.74,107.28 118.11,107.91 118.11,111.72 104.14,111.72 102.87,112.99 96.52,112.99 95.25,111.72 IC9.11
DQ9  (1 unrouted)
  Top 0.254: IC9.13 92.7,106.64 92.7,107.91 80.64,107.91 68.58,95.85 68.58,54.57 54.6,54.57 53.97,53.94 53.97,45.05 55.24,43.78 IC17.9
DQ10
  Top 0.254: 78.73,67.27 78.73,81.24 90.17,92.67 95.88,92.67 95.88,99.66 94.61,100.93 IC9.15
  Bottom 0.254: IC2.14 114.3,102.83 114.3,107.28 111.12,107.28 110.48,107.91 110.48,111.09 106.04,111.09 102.87,107.91 100.33,107.91 96.52,104.1 96.52,101.56 95.25,101.56 IC9.15 92.7,101.56 90.8,101.56 84.45,95.21 74.93,95.21 74.93,90.77 79.37,86.32 80.01,86.32 80.01,83.15 78.73,81.88 70.48,81.88 68.58,79.97 58.41,79.97 58.41,68.54 61.59,68.54 61.59,51.4 56.51,46.32 IC17.8
DQ11
  Top 0.254: IC2.12 109.22,102.83 109.22,103.47 105.41,107.28 105.41,107.91 100.33,107.91 99.06,106.64 99.06,87.59 87.62,87.59 80.01,79.97 80.01,57.11 69.84,57.11 69.21,56.48 69.21,48.22 IC17.7
  Bottom 0.254: IC9.17 95.25,96.48 95.88,97.12 99.69,97.12 100.33,97.75 104.14,97.75 105.41,99.02 107.95,99.02 109.22,100.29 IC2.12
DRL  (1 unrouted)
EA1  (3 unrouted)
EA2  (2 unrouted)
EA3  (2 unrouted)
EMA1  (2 unrouted)
EMA2  (2 unrouted)
EMA3  (3 unrouted)
  Top 0.254: 120.65,7.58 120.65,10.12 IC4.1
EMA4  (3 unrouted)
  Top 0.254: 120.01,8.22 120.01,12.03 120.65,12.66 IC4.2
EMA5  (3 unrouted)
  Top 0.254: 119.38,8.85 119.38,13.93 120.65,15.2 IC4.3
EWL
  Top 0.254: IC5.1 31.75,50.76 36.19,50.76 36.19,51.4 36.82,52.03 43.17,52.03 43.17,74.89 44.45,76.16 IC20.2
  Bottom 0.254: IC18.9 24.12,86.32 27.94,82.51 31.75,82.51 36.82,87.59 39.36,87.59 43.17,83.78 43.17,76.8 45.08,76.8 IC20.2
EWLSET  (1 unrouted)
GND  (8 unrouted)
  Top 0.508: C8.2 135.88,108.55 133.34,111.09 133.34,144.74 131.44,146.65 130.81,146.65 130.17,147.28 C10.2 128.9,147.28 128.9,145.38 82.55,145.38 78.73,141.57 78.73,110.45 59.68,110.45 58.41,109.18 58.41,91.4 60.32,89.5 IC22.8 | SV4.5 132.08,80.61 132.08,79.34 SV4.7 132.08,78.07 132.08,76.16 134.62,73.62 137.16,73.62 137.16,67.91 | 137.16,67.91 137.16,62.83 133.98,59.65 133.98,52.67 131.44,50.13 131.44,38.7 128.27,38.7 127,39.97 127,57.11 128.27,58.38 IC16.8 | 137.16,67.91 139.69,70.45 C1.2 140.33,71.72 140.33,81.24 139.69,81.88 Q1.3 | IC26.7 133.34,25.36 132.71,26 132.71,29.81 120.01,29.81 C9.2 | C7.2 95.88,76.16 92.7,72.99 88.9,72.99 88.9,72.35 IC13.8 | IC9.10 102.87,111.72 103.5,112.36 106.68,112.36 106.68,110.45 IC2.10 | IC17.11 IC17.30 | C6.2 43.81,48.22 43.81,64.1 45.08,65.37 IC27.7 46.35,66.64 47.62,67.91 47.62,88.23 46.98,88.86 IC20.7 | C2.2 17.78,28.54 15.23,31.08 15.23,72.99 C5.2 15.87,72.35 15.87,71.72 16.51,71.08 IC25.7 21.59,74.89 25.39,74.89 25.39,82.51 27.94,85.05 27.94,87.59 29.21,88.86 IC18.7 29.84,89.5 29.84,90.77 C4.2 29.84,91.4 29.84,100.29 | 29.84,100.29 24.12,100.29 23.49,100.93 23.49,101.56 19.05,101.56 IC28.7 | C3.2 IC7.7 34.92,112.36 34.92,100.29 29.84,100.29 | IC24.8 64.13,117.44 64.13,132.68 65.4,133.95 IC3.7
  Bottom 0.508: 142.87,106.64 142.87,130.14 131.44,141.57 130.17,141.57 IC8.10 | C8.2 142.87,106.64 | 142.87,106.64 142.87,98.39 142.24,98.39 138.43,94.58 138.43,91.4 Q1.3 | 131.44,149.19 145.41,135.22 145.41,67.91 135.88,58.38 130.81,58.38 IC16.8 | IC12.8 97.15,59.02 97.79,59.65 108.58,59.65 109.85,58.38 113.03,58.38 IC14.8 | IC13.8 88.9,72.35 88.9,75.53 85.72,78.7 84.45,78.7 SV1.2 | IC22.8 62.22,88.86 64.77,86.32 75.56,86.32 R6.2 | IC19.10 102.87,142.2 104.14,143.47 114.3,143.47 115.56,142.2 IC6.10 117.47,142.84 117.47,149.19 127,149.19 128.9,147.28 C10.2 129.53,147.92 127.63,149.82 82.55,149.82 67.31,134.58 IC3.7 64.77,134.58 63.49,135.85 56.51,135.85 56.51,134.58 51.43,129.5 36.82,129.5 35.55,130.77 IC10.7 | IC27.7 46.98,66 48.25,64.73 58.41,64.73 59.68,63.46 C11.2 | IC11.8 100.33,30.44 95.88,26 95.88,24.09 92.07,24.09 91.44,23.46 91.44,13.93 102.87,13.93 103.5,13.3 103.5,11.39 100.33,11.39 99.69,10.76 92.07,10.76 73.66,29.17 73.66,37.43 71.75,37.43 IC17.30 | C6.2 45.71,46.95 53.97,38.7 55.24,38.7 IC17.11 | C2.2 17.14,27.9 15.87,26.63 13.33,26.63 GND.MP | IC5.7 29.84,66 24.76,71.08 IC25.7 | IC20.7 44.45,88.86 42.54,90.77 31.11,90.77 C4.2 | IC24.8 59.68,114.26 58.41,115.53 49.52,115.53 48.89,114.9 IC21.7 46.98,114.26 45.08,116.17 36.19,116.17 34.28,114.26 IC7.7
IOT601
  Bottom 0.254: IC27.11 37.46,59.02 36.19,59.02 35.55,59.65 35.55,71.72 38.73,71.72 40,72.99 40,85.69 39.36,86.32 IC20.9
IOT621
  Top 0.254: IC10.6 38.09,130.77 41.9,126.96 41.9,115.53 42.54,114.9 42.54,113.63 41.27,112.36 IC21.9
LAD
  Top 0.254: IC3.11 57.78,126.96 57.78,128.87 IC3.10 57.78,129.5 57.78,131.41 IC3.9
N$1
  Bottom 0.254: 43.17,62.19 43.81,61.56 45.08,61.56 IC27.5 | 43.17,62.19 39.36,66 IC27.8 | 43.17,62.19 58.41,62.19 59.68,60.92 C11.1
N$2  (1 unrouted)
  Top 0.254: IC21.12 40,104.74 40,106.01 IC21.11
N$3  (1 unrouted)
N$4
  Bottom 0.254: IC10.12 46.35,125.06 49.52,128.23 63.49,128.23 64.77,129.5 IC3.5
N$5
  Bottom 0.254: Q1.1 142.24,90.77 136.52,85.05 126.36,85.05 125.09,83.78 R4.2
N$6
  Top 0.254: SV4.6 R5.2
N$10
  Top 0.254: IC14.4 113.03,48.22 108.58,43.78 107.95,43.78 107.95,44.41 100.33,44.41 100.33,60.92 99.06,62.19 IC13.13
N$11
  Bottom 0.254: IC12.13 89.53,48.86 95.25,54.57 115.56,54.57 121.92,60.92 132.08,60.92 133.34,62.19 133.34,67.91 102.23,67.91 99.69,70.45 IC13.4
N$12
  Bottom 0.254: IC11.13 94.61,20.92 100.33,26.63 108.58,26.63 120.65,38.7 130.17,38.7 131.44,39.97 131.44,44.41 110.48,44.41 107.95,46.95 101.59,46.95 100.33,48.22 IC12.4
N$13  (1 unrouted)
N$14  (1 unrouted)
N$15
  Top 0.254: IC5.11 22.22,58.38 22.22,60.29 IC5.10
N$17  (1 unrouted)
N$19  (1 unrouted)
N$21  (1 unrouted)
N$22  (1 unrouted)
N$23
  Top 0.254: Q1.2 140.97,93.94 142.24,95.21 R7.1
NED
  Top 0.254: IC20.6 44.45,86.32 43.81,85.69 43.81,80.61 45.08,79.34 IC20.3 44.45,78.7 40.63,74.89 40.63,63.46 39.36,62.19 34.28,62.19 34.28,60.92 31.75,58.38 IC5.4
  Bottom 0.254: IC5.4 29.84,58.38 26.03,62.19 16.51,62.19 IC25.9
NEDSET  (1 unrouted)
NOERR
  Bottom 0.254: IC21.8 41.27,113.63 46.98,107.91 49.52,107.91 50.16,107.28 50.16,106.01 49.52,105.37 46.98,105.37 46.35,104.74 46.35,100.29 54.6,100.29 55.88,99.02 55.88,82.51 48.25,82.51 46.98,81.24 IC20.4
PWRCLR  (1 unrouted)
  Top 0.254: IC25.4 20.32,66 20.32,68.54 28.57,76.8 28.57,86.96 29.21,87.59 36.82,87.59 36.82,88.86 IC20.8
  Bottom 0.254: 80.64,76.16 SV1.3
TRC
  Top 0.254: IC5.5 31.75,60.92 36.19,65.37 36.19,69.18 40,72.99 40,78.07 43.17,81.24 43.17,91.4 50.16,98.39 50.16,109.82 48.89,111.09 IC21.6
  Bottom 0.254: IC18.5 36.82,90.13 39.36,90.13 43.81,85.69 43.81,77.43 46.98,77.43 47.62,76.8 47.62,67.27 36.82,67.27 36.19,66.64 36.19,60.29 36.82,59.65 39.36,59.65 40,59.02 40,57.11 35.55,57.11 31.75,60.92 IC5.5
V+
  Top 0.254: 99.69,88.23 99.69,97.75 102.87,97.75 106.04,100.93 IC2.11 | 99.69,88.23 105.41,82.51 114.93,82.51 114.93,66.64 116.84,64.73 IC15.9 | IC16.9 120.65,58.38 120.01,59.02 120.01,62.83 IC15.10 | 99.69,88.23 99.69,82.51 85.09,82.51 82.55,79.97 82.55,57.75 83.18,57.11 R1.1 | SV2.31 81.28,98.39 82.55,97.12 82.55,95.85 81.28,94.58 SV2.35 SV2.37 SV2.39 81.28,86.96 78.73,84.42 R2.1 | IC22.14 52.7,76.16 52.7,74.26 IC22.15 52.06,73.62 48.25,69.81 48.25,55.84 46.35,53.94 IC27.2 45.08,52.67 45.08,51.4 IC27.1 | IC27.10 37.46,60.29 36.19,59.02 36.19,55.21 37.46,53.94 IC27.13 | IC25.12 8.25,62.83 8.25,64.1 IC25.10 12.06,67.91 12.06,78.7 IC18.12
  Bottom 0.254: IC15.9 117.47,62.83 119.38,62.83 IC15.10 | IC2.11 106.04,102.2 105.41,102.83 100.33,102.83 99.69,103.47 99.69,105.37 107.95,105.37 110.48,102.83 110.48,97.75 105.41,97.75 102.87,95.21 89.53,95.21 84.45,90.13 83.18,90.13 81.91,91.4 SV2.37 | IC27.2 IC27.13 37.46,53.94 34.28,57.11 20.32,57.11 19.05,58.38 IC25.2 16.51,58.38 13.96,60.92 IC25.12 | 26.03,80.61 26.67,81.24 IC18.4 | 25.39,79.97 26.03,80.61 | 25.39,79.97 24.12,78.7 IC18.12 | 25.39,79.97 29.21,76.16 IC18.2 | 26.03,80.61 IC18.10 | IC22.14 53.97,76.8 59.68,82.51 76.83,82.51 78.1,83.78 R2.1
VCC  (7 unrouted)
  Top 0.508: SV4.4 134.62,84.42 134.62,85.69 SV4.2 134.62,86.96 134.62,98.39 135.25,99.02 135.88,99.02 C8.1 137.16,101.56 137.79,102.2 | 137.79,102.2 137.79,110.45 135.25,110.45 134.62,111.09 134.62,150.46 126.36,150.46 125.73,149.82 125.73,147.92 125.09,147.28 C10.1 68.58,147.28 68.58,118.71 62.86,112.99 59.68,112.99 59.05,113.63 59.05,118.71 IC3.14 | C9.1 114.3,31.08 114.3,34.25 114.93,34.89 114.93,35.52 115.56,36.16 116.2,36.16 116.84,36.79 116.84,37.43 117.47,38.06 117.47,40.6 120.65,40.6 IC16.16 123.19,40.6 125.73,40.6 125.73,39.97 126.36,39.33 126.36,38.06 127,37.43 132.71,37.43 132.71,50.13 133.34,50.76 135.25,50.76 135.25,59.65 135.88,60.29 140.33,60.29 140.33,65.37 C1.1 140.33,66.64 143.5,66.64 143.5,78.7 | 143.5,78.7 150.49,78.7 151.12,78.07 151.12,10.12 145.41,10.12 144.78,9.49 144.78,8.85 132.71,8.85 132.08,9.49 127.63,9.49 IC26.14 125.73,10.12 125.73,6.31 118.74,6.31 114.93,10.12 IC4.16 | 143.5,78.7 R5.1 143.5,85.05 144.14,85.69 144.14,102.2 137.79,102.2 | IC13.16 106.68,64.73 106.68,67.27 106.04,67.91 87.62,67.91 87.62,73.62 88.26,74.26 91.44,74.26 91.44,75.53 C7.1 | IC22.16 53.97,71.72 55.24,72.99 55.24,94.58 IC24.16 | IC7.14 24.76,98.39 24.76,91.4 C4.1 | IC27.14 38.73,50.13 39.36,49.49 39.36,47.59 C6.1 | 84.45,26.63 84.45,20.92 92.7,12.66 IC11.16 | 84.45,26.63 84.45,28.54 85.09,29.17 85.09,36.79 88.26,39.97 IC12.16 | +5V.MP 12.06,33.62 10.79,34.89 10.79,55.21 IC25.14 7.62,58.38 7.62,72.99 C5.1 | 84.45,26.63 43.17,26.63 43.17,27.9 23.49,47.59 23.49,50.13 IC5.14
  Bottom 0.508: SV4.8 134.62,79.34 135.25,79.97 135.88,79.97 136.52,80.61 136.52,81.24 137.16,81.88 137.16,83.78 SV4.4 | C8.1 IC2.20 | IC15.16 134.62,64.73 134.62,66 139.69,66 C1.1 | IC21.14 39.36,99.02 38.09,97.75 27.94,97.75 26.67,99.02 IC7.14 23.49,100.93 23.49,112.99 26.67,112.99 33.02,119.34 | 12.06,84.42 10.79,85.69 IC28.14 | 12.06,84.42 17.78,78.7 | 17.78,78.7 IC18.14 24.12,73.62 25.39,72.35 35.55,72.35 36.82,73.62 IC20.14 | 17.78,78.7 17.14,78.7 11.42,72.99 C5.1 | 12.06,84.42 19.68,84.42 19.68,85.69 21.59,87.59 24.76,87.59 24.76,90.77 C4.1 26.03,91.4 27.3,92.67 48.25,92.67 52.06,96.48 IC24.16 | IC17.40 72.39,63.46 74.29,61.56 74.29,41.87 52.7,41.87 45.71,48.86 42.54,48.86 40.63,46.95 C6.1 | C2.1 17.14,32.98 +5V.MP | IC25.14 11.42,55.84 12.69,54.57 18.41,54.57 22.22,50.76 IC5.14 24.12,50.76 26.03,48.86 36.19,48.86 37.46,50.13 IC27.14 | 55.88,119.34 51.43,123.79 IC10.14 | 55.88,119.34 57.14,119.34 IC3.14 59.68,119.34 63.49,115.53 88.9,115.53 92.7,119.34 IC19.20 | 55.88,119.34 33.02,119.34 | 33.02,119.34 31.11,119.34 28.57,116.8 C3.1
WRITELOCK_LED
  Bottom 0.254: R3.1 SV4.1

### Text on the board
tNames: DF32x4 Disk Emulator Rev. B (c)2003 CEMorris